# Altium project FPGA_Board.PrjPCB (part 1 of 2)
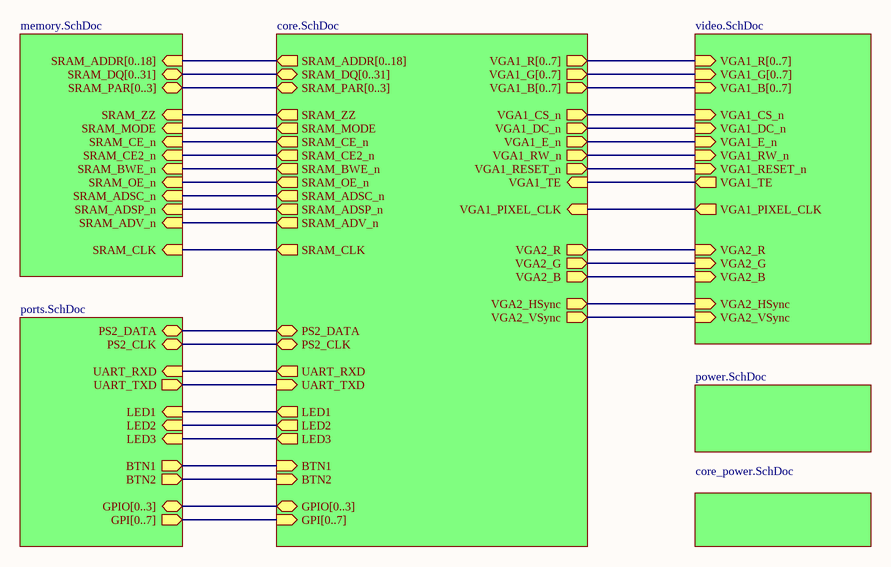
[diagram p0: FPGA_board.SchDoc]
7 sheets, 242 parts. Net scope: hierarchical (ports join the sheet entries above them; power ports are global).
Board file: FPGA_board.PcbDoc
Sheets:
  FPGA_board.SchDoc
    Designator = core.SchDoc
    Designator = Video.SchDoc
    Designator = ports.SchDoc
    Designator = power.SchDoc
    Designator = memory.SchDoc
    Designator = core_power.SchDoc

## Sheet FPGA_board.SchDoc
size A4

### Sub-sheets
Designator = core.SchDoc: SRAM_ADDR[0..18] (out), SRAM_DQ[0..31] (bidir), SRAM_PAR[0..3] (bidir), VGA1_R[0..7] (out), VGA1_G[0..7] (out), VGA1_B[0..7] (out), GPIO[0..3] (bidir), PS2_DATA (bidir), PS2_CLK (bidir), VGA1_PIXEL_CLK (in), VGA1_RESET_n (out), VGA1_CS_n (out), SRAM_ZZ (out), VGA1_TE (in), VGA1_E_n (out), VGA1_RW_n (out), VGA1_DC_n (out), BTN1 (in), BTN2 (in), LED1 (out), LED2 (out), LED3 (out), VGA2_R (out), VGA2_G (out), VGA2_B (out), VGA2_HSync (out), VGA2_VSync (out), SRAM_MODE (out), SRAM_CLK (out), SRAM_CE_n (out), SRAM_CE2_n (out), SRAM_BWE_n (out), SRAM_OE_n (out), SRAM_ADSC_n (out), SRAM_ADSP_n (out), SRAM_ADV_n (out), UART_RXD (out), UART_TXD (in), GPI[0..7] (in)
Designator = video.SchDoc: VGA1_R[0..7] (in), VGA1_G[0..7] (in), VGA1_B[0..7] (in), VGA1_CS_n (in), VGA1_DC_n (in), VGA1_RW_n (in), VGA1_E_n (in), VGA1_RESET_n (in), VGA1_TE (out), VGA1_PIXEL_CLK (out), VGA2_G (in), VGA2_B (in), VGA2_VSync (in), VGA2_HSync (in), VGA2_R (in)
Designator = ports.SchDoc: BTN1 (out), BTN2 (out), PS2_DATA (bidir), PS2_CLK (bidir), UART_RXD (in), UART_TXD (out), LED1 (in), LED2 (in), LED3 (in), GPIO[0..3] (bidir), GPI[0..7] (out)
Designator = power.SchDoc: no entries
Designator = memory.SchDoc: SRAM_ADDR[0..18] (in), SRAM_DQ[0..31] (bidir), SRAM_PAR[0..3] (bidir), SRAM_ZZ (in), SRAM_MODE (in), SRAM_CLK (in), SRAM_CE_n (in), SRAM_CE2_n (in), SRAM_BWE_n (in), SRAM_OE_n (in), SRAM_ADSC_n (in), SRAM_ADSP_n (in), SRAM_ADV_n (in)
Designator = core_power.SchDoc: no entries

### Nets
BTN1: sheet Designator/BTN1, sheet Designator/BTN1
BTN2: sheet Designator/BTN2, sheet Designator/BTN2
LED1: sheet Designator/LED1, sheet Designator/LED1
LED2: sheet Designator/LED2, sheet Designator/LED2
LED3: sheet Designator/LED3, sheet Designator/LED3
PS2_CLK: sheet Designator/PS2_CLK, sheet Designator/PS2_CLK
PS2_DATA: sheet Designator/PS2_DATA, sheet Designator/PS2_DATA
SRAM_ADSC_n: sheet Designator/SRAM_ADSC_n, sheet Designator/SRAM_ADSC_n
SRAM_ADSP_n: sheet Designator/SRAM_ADSP_n, sheet Designator/SRAM_ADSP_n
SRAM_ADV_n: sheet Designator/SRAM_ADV_n, sheet Designator/SRAM_ADV_n
SRAM_BWE_n: sheet Designator/SRAM_BWE_n, sheet Designator/SRAM_BWE_n
SRAM_CE2_n: sheet Designator/SRAM_CE2_n, sheet Designator/SRAM_CE2_n
SRAM_CE_n: sheet Designator/SRAM_CE_n, sheet Designator/SRAM_CE_n
SRAM_CLK: sheet Designator/SRAM_CLK, sheet Designator/SRAM_CLK
SRAM_MODE: sheet Designator/SRAM_MODE, sheet Designator/SRAM_MODE
SRAM_OE_n: sheet Designator/SRAM_OE_n, sheet Designator/SRAM_OE_n
SRAM_ZZ: sheet Designator/SRAM_ZZ, sheet Designator/SRAM_ZZ
UART_RXD: sheet Designator/UART_RXD, sheet Designator/UART_RXD
UART_TXD: sheet Designator/UART_TXD, sheet Designator/UART_TXD
VGA1_CS_n: sheet Designator/VGA1_CS_n, sheet Designator/VGA1_CS_n
VGA1_DC_n: sheet Designator/VGA1_DC_n, sheet Designator/VGA1_DC_n
VGA1_E_n: sheet Designator/VGA1_E_n, sheet Designator/VGA1_E_n
VGA1_PIXEL_CLK: sheet Designator/VGA1_PIXEL_CLK, sheet Designator/VGA1_PIXEL_CLK
VGA1_RESET_n: sheet Designator/VGA1_RESET_n, sheet Designator/VGA1_RESET_n
VGA1_RW_n: sheet Designator/VGA1_RW_n, sheet Designator/VGA1_RW_n
VGA1_TE: sheet Designator/VGA1_TE, sheet Designator/VGA1_TE
VGA2_B: sheet Designator/VGA2_B, sheet Designator/VGA2_B
VGA2_G: sheet Designator/VGA2_G, sheet Designator/VGA2_G
VGA2_HSync: sheet Designator/VGA2_HSync, sheet Designator/VGA2_HSync
VGA2_R: sheet Designator/VGA2_R, sheet Designator/VGA2_R
VGA2_VSync: sheet Designator/VGA2_VSync, sheet Designator/VGA2_VSync

## Sheet core.SchDoc
size A3
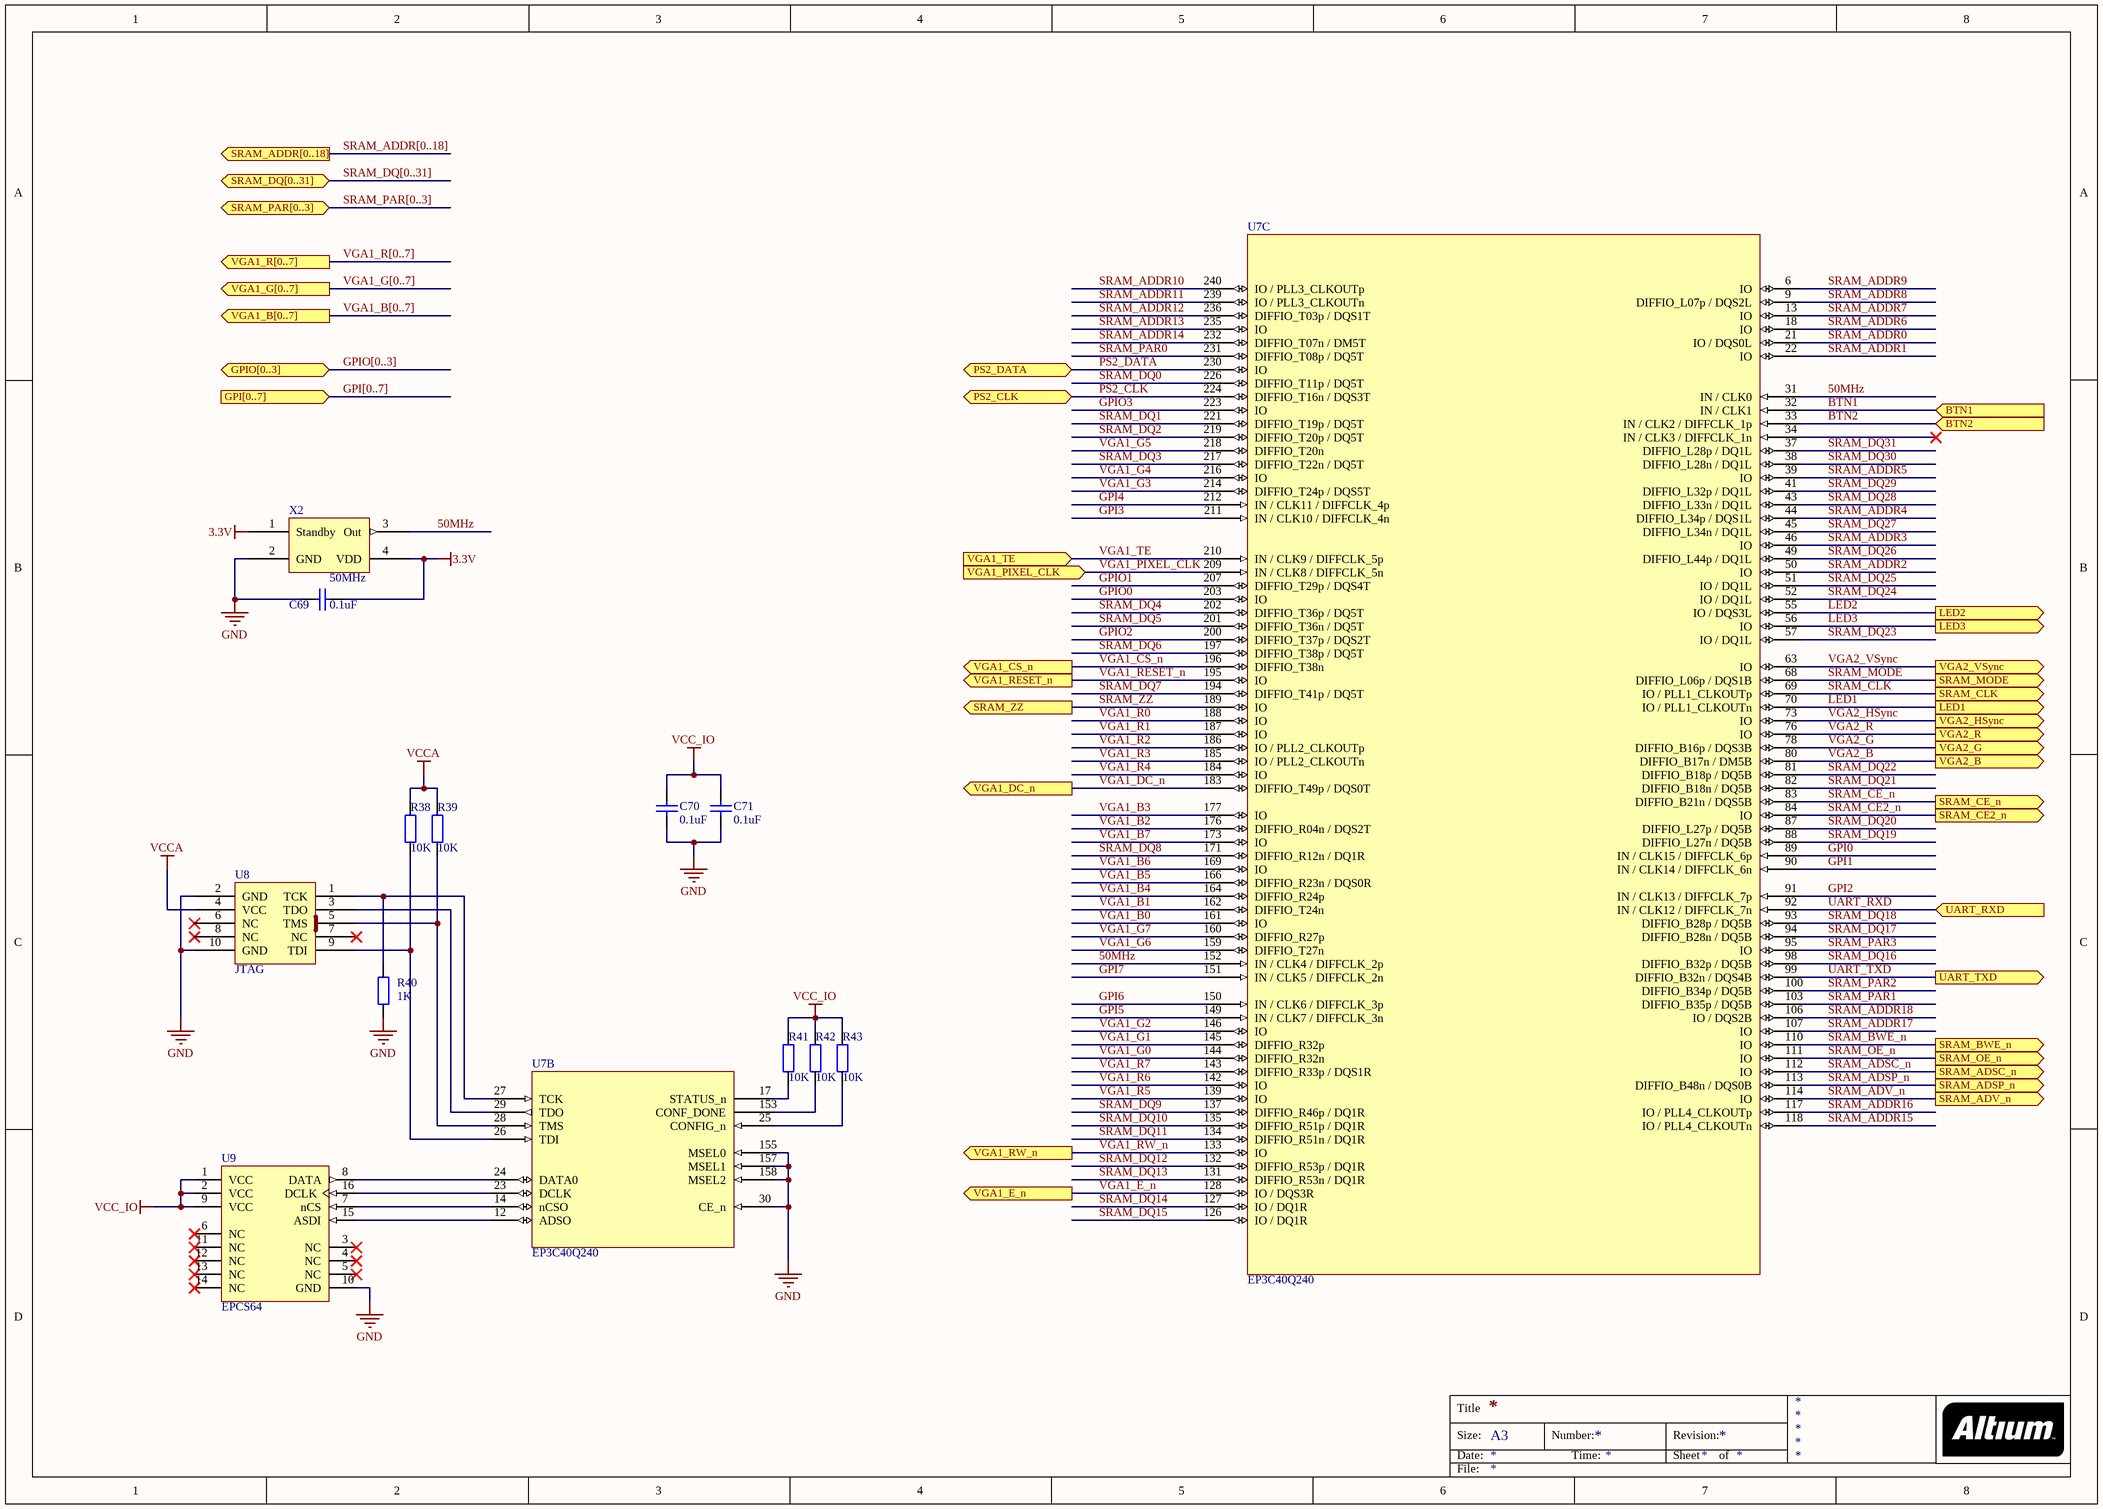
[diagram p1: core.SchDoc]

### Parts
C69  value 0.1uF  [0402]  (hidden comment: Cap)
C70  value 0.1uF  [0402]  (hidden comment: Cap)
C71  value 0.1uF  [0402]  (hidden comment: Cap)
R38  value 10K  [J1-0603]  (hidden comment: Res2)
R39  value 10K  [J1-0603]  (hidden comment: Res2)
R40  value 1K  [J1-0603]  (hidden comment: Res2)
R41  value 10K  [J1-0603]  (hidden comment: Res2)
R42  value 10K  [J1-0603]  (hidden comment: Res2)
R43  value 10K  [J1-0603]  (hidden comment: Res2)
U7  EP3C40Q240  [PQFP240]  (parts B,C of 3)
U8  JTAG  [JTAG_CONN]
U9  EPCS64  [SOIC16]
X2  50MHz  [ASDMB]

### Ports
BTN1 (in), BTN2 (in), GPI[0..7] (in), GPIO[0..3] (bidir), LED1 (out), LED2 (out), LED3 (out), PS2_CLK (bidir), PS2_DATA (bidir), SRAM_ADDR[0..18] (out), SRAM_ADSC_n (out), SRAM_ADSP_n (out), SRAM_ADV_n (out), SRAM_BWE_n (out), SRAM_CE2_n (out), SRAM_CE_n (out), SRAM_CLK (out), SRAM_DQ[0..31] (bidir), SRAM_MODE (out), SRAM_OE_n (out), SRAM_PAR[0..3] (bidir), SRAM_ZZ (out), UART_RXD (in), UART_TXD (out), VGA1_B[0..7] (out), VGA1_CS_n (out), VGA1_DC_n (out), VGA1_E_n (out), VGA1_G[0..7] (out), VGA1_PIXEL_CLK (in), VGA1_R[0..7] (out), VGA1_RESET_n (out), VGA1_RW_n (out), VGA1_TE (in), VGA2_B (out), VGA2_G (out), VGA2_HSync (out), VGA2_R (out), VGA2_VSync (out)

### Nets
3.3V: C69.2 C70.2 C71.2 R41.1 R42.1 R43.1 U9.1(VCC) U9.2(VCC) U9.9(VCC) X2.1(Standby) X2.4(VDD)  [also labelled VCC_IO]
GND: C69.1 C70.1 C71.1 R40.1 U7.30(CE_n) U7.155(MSEL0) U7.157(MSEL1) U7.158(MSEL2) U8.2(GND) U8.10(GND) U9.10(GND) X2.2(GND)
VCCA: R38.1 R39.1 U8.4(VCC)  [project net 2.5V]
50MHz: U7.31(IN_/_CLK0) U7.152(IN_/_CLK4_/_DIFFCLK_2p) X2.3(Out)
BTN1: U7.32(IN_/_CLK1) ; port BTN1
BTN2: U7.33(IN_/_CLK2_/_DIFFCLK_1p) ; port BTN2
GPI0: U7.89(IN_/_CLK15_/_DIFFCLK_6p)
GPI1: U7.90(IN_/_CLK14_/_DIFFCLK_6n)
GPI2: U7.91(IN_/_CLK13_/_DIFFCLK_7p)
GPI3: U7.211(IN_/_CLK10_/_DIFFCLK_4n)
GPI4: U7.212(IN_/_CLK11_/_DIFFCLK_4p)
GPI5: U7.149(IN_/_CLK7_/_DIFFCLK_3n)
GPI6: U7.150(IN_/_CLK6_/_DIFFCLK_3p)
GPI7: U7.151(IN_/_CLK5_/_DIFFCLK_2n)
GPIO0: U7.203(IO)
GPIO1: U7.207(DIFFIO_T29p_/_DQS4T)
GPIO2: U7.200(DIFFIO_T37p_/_DQS2T)
GPIO3: U7.223(IO)
LED1: U7.70(IO_/_PLL1_CLKOUTn) ; port LED1
LED2: U7.55(IO_/_DQS3L) ; port LED2
LED3: U7.56(IO) ; port LED3
PS2_CLK: U7.224(DIFFIO_T16n_/_DQS3T) ; port PS2_CLK
PS2_DATA: U7.230(IO) ; port PS2_DATA
SRAM_ADDR0: U7.21(IO_/_DQS0L)
SRAM_ADDR1: U7.22(IO)
SRAM_ADDR2: U7.50(IO)
SRAM_ADDR3: U7.46(IO)
SRAM_ADDR4: U7.44(DIFFIO_L34p_/_DQS1L)
SRAM_ADDR5: U7.39(IO)
SRAM_ADDR6: U7.18(IO)
SRAM_ADDR7: U7.13(IO)
SRAM_ADDR8: U7.9(DIFFIO_L07p_/_DQS2L)
SRAM_ADDR9: U7.6(IO)
SRAM_ADDR10: U7.240(IO_/_PLL3_CLKOUTp)
SRAM_ADDR11: U7.239(IO_/_PLL3_CLKOUTn)
SRAM_ADDR12: U7.236(DIFFIO_T03p_/_DQS1T)
SRAM_ADDR13: U7.235(IO)
SRAM_ADDR14: U7.232(DIFFIO_T07n_/_DM5T)
SRAM_ADDR15: U7.118(IO_/_PLL4_CLKOUTn)
SRAM_ADDR16: U7.117(IO_/_PLL4_CLKOUTp)
SRAM_ADDR17: U7.107(IO)
SRAM_ADDR18: U7.106(IO_/_DQS2B)
SRAM_ADSC_n: U7.112(IO) ; port SRAM_ADSC_n
SRAM_ADSP_n: U7.113(DIFFIO_B48n_/_DQS0B) ; port SRAM_ADSP_n
SRAM_ADV_n: U7.114(IO) ; port SRAM_ADV_n
SRAM_BWE_n: U7.110(IO) ; port SRAM_BWE_n
SRAM_CE2_n: U7.84(IO) ; port SRAM_CE2_n
SRAM_CE_n: U7.83(DIFFIO_B21n_/_DQS5B) ; port SRAM_CE_n
SRAM_CLK: U7.69(IO_/_PLL1_CLKOUTp) ; port SRAM_CLK
SRAM_DQ0: U7.226(DIFFIO_T11p_/_DQ5T)
SRAM_DQ1: U7.221(DIFFIO_T19p_/_DQ5T)
SRAM_DQ2: U7.219(DIFFIO_T20p_/_DQ5T)
SRAM_DQ3: U7.217(DIFFIO_T22n_/_DQ5T)
SRAM_DQ4: U7.202(DIFFIO_T36p_/_DQ5T)
SRAM_DQ5: U7.201(DIFFIO_T36n_/_DQ5T)
SRAM_DQ6: U7.197(DIFFIO_T38p_/_DQ5T)
SRAM_DQ7: U7.194(DIFFIO_T41p_/_DQ5T)
SRAM_DQ8: U7.171(DIFFIO_R12n_/_DQ1R)
SRAM_DQ9: U7.137(DIFFIO_R46p_/_DQ1R)
SRAM_DQ10: U7.135(DIFFIO_R51p_/_DQ1R)
SRAM_DQ11: U7.134(DIFFIO_R51n_/_DQ1R)
SRAM_DQ12: U7.132(DIFFIO_R53p_/_DQ1R)
SRAM_DQ13: U7.131(DIFFIO_R53n_/_DQ1R)
SRAM_DQ14: U7.127(IO_/_DQ1R)
SRAM_DQ15: U7.126(IO_/_DQ1R)
SRAM_DQ16: U7.98(DIFFIO_B32p_/_DQ5B)
SRAM_DQ17: U7.94(DIFFIO_B28n_/_DQ5B)
SRAM_DQ18: U7.93(DIFFIO_B28p_/_DQ5B)
SRAM_DQ19: U7.88(DIFFIO_L27n_/_DQ5B)
SRAM_DQ20: U7.87(DIFFIO_L27p_/_DQ5B)
SRAM_DQ21: U7.82(DIFFIO_B18n_/_DQ5B)
SRAM_DQ22: U7.81(DIFFIO_B18p_/_DQ5B)
SRAM_DQ23: U7.57(IO_/_DQ1L)
SRAM_DQ24: U7.52(IO_/_DQ1L)
SRAM_DQ25: U7.51(IO_/_DQ1L)
SRAM_DQ26: U7.49(DIFFIO_L44p_/_DQ1L)
SRAM_DQ27: U7.45(DIFFIO_L34n_/_DQ1L)
SRAM_DQ28: U7.43(DIFFIO_L33n_/_DQ1L)
SRAM_DQ29: U7.41(DIFFIO_L32p_/_DQ1L)
SRAM_DQ30: U7.38(DIFFIO_L28n_/_DQ1L)
SRAM_DQ31: U7.37(DIFFIO_L28p_/_DQ1L)
SRAM_MODE: U7.68(DIFFIO_L06p_/_DQS1B) ; port SRAM_MODE
SRAM_OE_n: U7.111(IO) ; port SRAM_OE_n
SRAM_PAR0: U7.231(DIFFIO_T08p_/_DQ5T)
SRAM_PAR1: U7.103(DIFFIO_B35p_/_DQ5B)
SRAM_PAR2: U7.100(DIFFIO_B34p_/_DQ5B)
SRAM_PAR3: U7.95(IO)
SRAM_ZZ: U7.189(IO) ; port SRAM_ZZ
UART_RXD: U7.92(IN_/_CLK12_/_DIFFCLK_7n) ; port UART_RXD
UART_TXD: U7.99(DIFFIO_B32n_/_DQS4B) ; port UART_TXD
VGA1_B0: U7.161(IO)
VGA1_B1: U7.162(DIFFIO_T24n)
VGA1_B2: U7.176(DIFFIO_R04n_/_DQS2T)
VGA1_B3: U7.177(IO)
VGA1_B4: U7.164(DIFFIO_R24p)
VGA1_B5: U7.166(DIFFIO_R23n_/_DQS0R)
VGA1_B6: U7.169(IO)
VGA1_B7: U7.173(IO)
VGA1_CS_n: U7.196(DIFFIO_T38n) ; port VGA1_CS_n
VGA1_DC_n: U7.183(DIFFIO_T49p_/_DQS0T) ; port VGA1_DC_n
VGA1_E_n: U7.128(IO_/_DQS3R) ; port VGA1_E_n
VGA1_G0: U7.144(DIFFIO_R32n)
VGA1_G1: U7.145(DIFFIO_R32p)
VGA1_G2: U7.146(IO)
VGA1_G3: U7.214(DIFFIO_T24p_/_DQS5T)
VGA1_G4: U7.216(IO)
VGA1_G5: U7.218(DIFFIO_T20n)
VGA1_G6: U7.159(DIFFIO_T27n)
VGA1_G7: U7.160(DIFFIO_R27p)
VGA1_PIXEL_CLK: U7.209(IN_/_CLK8_/_DIFFCLK_5n) ; port VGA1_PIXEL_CLK
VGA1_R0: U7.188(IO)
VGA1_R1: U7.187(IO)
VGA1_R2: U7.186(IO_/_PLL2_CLKOUTp)
VGA1_R3: U7.185(IO_/_PLL2_CLKOUTn)
VGA1_R4: U7.184(IO)
VGA1_R5: U7.139(IO)
VGA1_R6: U7.142(IO)
VGA1_R7: U7.143(DIFFIO_R33p_/_DQS1R)
VGA1_RESET_n: U7.195(IO) ; port VGA1_RESET_n
VGA1_RW_n: U7.133(IO) ; port VGA1_RW_n
VGA1_TE: U7.210(IN_/_CLK9_/_DIFFCLK_5p) ; port VGA1_TE
VGA2_B: U7.80(DIFFIO_B17n_/_DM5B) ; port VGA2_B
VGA2_G: U7.78(DIFFIO_B16p_/_DQS3B) ; port VGA2_G
VGA2_HSync: U7.73(IO) ; port VGA2_HSync
VGA2_R: U7.76(IO) ; port VGA2_R
VGA2_VSync: U7.63(IO) ; port VGA2_VSync
NetR38_2: R38.2 U7.26(TDI) U8.9(TDI)
NetR39_2: R39.2 U7.28(TMS) U8.5(TMS)
NetR40_2: R40.2 U7.27(TCK) U8.1(TCK)
NetR41_2: R41.2 U7.17(STATUS_n)
NetR42_2: R42.2 U7.153(CONF_DONE)
NetR43_2: R43.2 U7.25(CONFIG_n)
NetU7_12: U7.12(ADSO) U9.15(ASDI)
NetU7_14: U7.14(nCSO) U9.7(nCS)
NetU7_23: U7.23(DCLK) U9.16(DCLK)
NetU7_24: U7.24(DATA0) U9.8(DATA)
NetU7_29: U7.29(TDO) U8.3(TDO)

Not connected (* = marked no-connect by the designer): U7 34(IN_/_CLK3_/_DIFFCLK_1n)*; U8 6(NC)* 7(NC)* 8(NC)*; U9 3(NC)* 4(NC)* 5(NC)* 6(NC)* 11(NC)* 12(NC)* 13(NC)* 14(NC)*

### Buses and harness runs
bus GPI[0..7] = port GPI[0..7]
bus GPIO[0..3] = port GPIO[0..3]
bus SRAM_ADDR[0..18] = port SRAM_ADDR[0..18]
bus SRAM_DQ[0..31] = port SRAM_DQ[0..31]
bus SRAM_PAR[0..3] = port SRAM_PAR[0..3]
bus VGA1_B[0..7] = port VGA1_B[0..7]
bus VGA1_G[0..7] = port VGA1_G[0..7]
bus VGA1_R[0..7] = port VGA1_R[0..7]

### Notes on the sheet
- Title
- Size:
- Date:
- A3
- Number:
- Time:
- Revision:
- Sheet
- of
- File:

### Library data of the parts
C69-C71 = Cap: Capacitor; Published: 8-Jun-2000; LatestRevisionDate: 17-Jul-2002; LatestRevisionNote: Re-released for DXP Platform.; PackageReference: RAD-0.3; Publisher: Altium Limited; PackageDescription: Radial Cap, Thru-Hole; 2 Leads; 0.3 in Pin Spacing
R38-R43 = Res2: Resistor; Published: 8-Jun-2000; LatestRevisionDate: 17-Jul-2002; LatestRevisionNote: Re-released for DXP Platform.; PackageReference: AXIAL-0.4; Publisher: Altium Limited; PackageDescription: Axial Device, Thru-Hole; 2 Leads; 0.4 in Pin Spacing
U8 = JTAG_CONN
U9 = EPCS16SI16N: EPCS16 Series, In-system programmable 3.3V serial configuration device, 16-Pin SOIC, 16-Megabit, Industrial Grade, Pb-Free; Configures: Cyclone II, Stratix II, & Cyclone Devices; Published: 4-Mar-2005; LatestRevisionDate: 13-Apr-2006; LatestRevisionNote: IPC-7351 Footprint Added.; DatasheetVersion: ver2.0, Oct-2003; PackageVersion: ver14.2, Oct-2005; PackageReference: SOIC16; Publisher: Altium Limited; PackageDescription: 16-Pin Small Outline Integrated Circuit Package (SOIC16); Supplier 1: Digi-Key; Supplier Part Number 1: 544-1240-5-ND; Supplier 2: Farnell; Supplier Part Number 2: 1453493; Supplier 3: Farnell; Supplier Part Number 3: 1662261; Code_JEDEC: MS-013-AA; Code_IPC: SOIC127P1030-16; ComponentLink1Description: Manufacturer Link; ComponentLink1URL: http://www.altera.com/products/devices/config/cfg-index.html; ComponentLink2Description: Configuration Handbook; ComponentLink2URL: http://www.altera.com/literature/hb/cfg/config_handbook.pdf; ComponentLink3Description: Pinout Specification; ComponentLink3URL: http://www.altera.com/literature/hb/cfg/config_handbook.pdf; ComponentLink4Description: Packaging Specification; ComponentLink4URL: http://www.altera.com/support/devices/packaging/specifications/pkg-pin/pdf/016-SOIC.pdf
X2 = ASDMB-50.000MHZ-LY-T

## Sheet Video.SchDoc
size A3
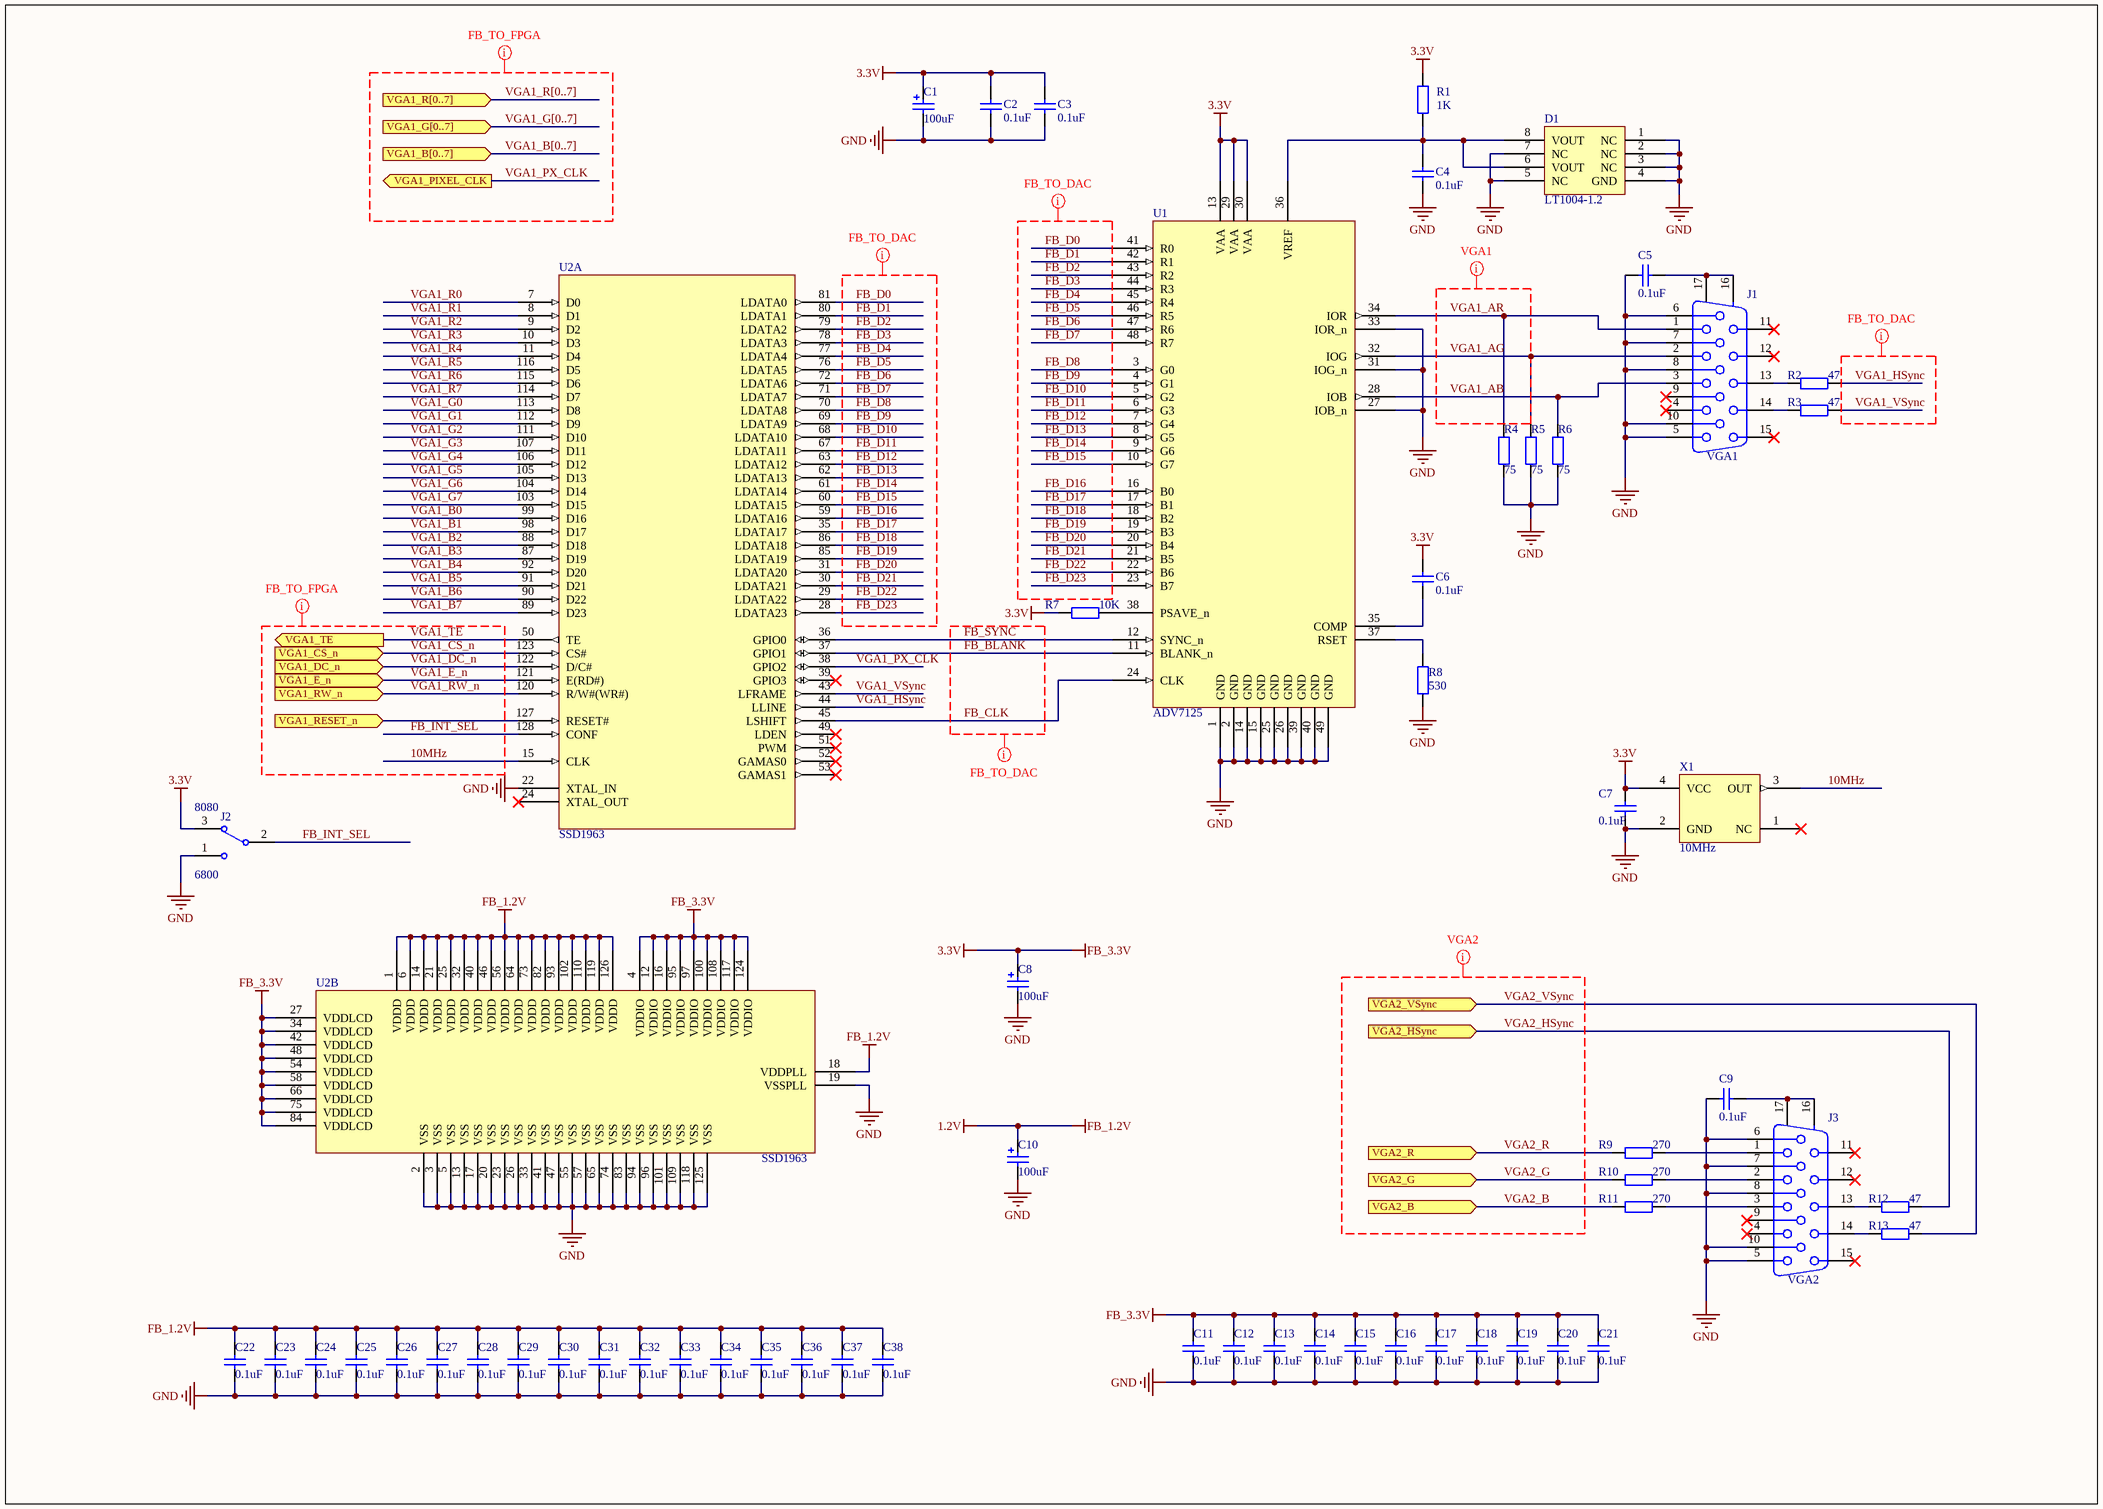
[diagram p2: Video.SchDoc]

### Parts
C1  value 100uF  [C1206_POLARIZED]  (hidden comment: Cap Pol2)
C2  value 0.1uF  [0402]  (hidden comment: Cap)
C3  value 0.1uF  [0402]  (hidden comment: Cap)
C4  value 0.1uF  [0402]  (hidden comment: Cap)
C5  value 0.1uF  [0402]  (hidden comment: Cap)
C6  value 0.1uF  [0402]  (hidden comment: Cap)
C7  value 0.1uF  [0402]  (hidden comment: Cap)
C8  value 100uF  [C1206_POLARIZED]  (hidden comment: Cap Pol2)
C9  value 0.1uF  [0402]  (hidden comment: Cap)
C10  value 100uF  [C1206_POLARIZED]  (hidden comment: Cap Pol2)
C11  value 0.1uF  [0402]  (hidden comment: Cap)
C12  value 0.1uF  [0402]  (hidden comment: Cap)
C13  value 0.1uF  [0402]  (hidden comment: Cap)
C14  value 0.1uF  [0402]  (hidden comment: Cap)
C15  value 0.1uF  [0402]  (hidden comment: Cap)
C16  value 0.1uF  [0402]  (hidden comment: Cap)
C17  value 0.1uF  [0402]  (hidden comment: Cap)
C18  value 0.1uF  [0402]  (hidden comment: Cap)
C19  value 0.1uF  [0402]  (hidden comment: Cap)
C20  value 0.1uF  [0402]  (hidden comment: Cap)
C21  value 0.1uF  [0402]  (hidden comment: Cap)
C22  value 0.1uF  [0402]  (hidden comment: Cap)
C23  value 0.1uF  [0402]  (hidden comment: Cap)
C24  value 0.1uF  [0402]  (hidden comment: Cap)
C25  value 0.1uF  [0402]  (hidden comment: Cap)
C26  value 0.1uF  [0402]  (hidden comment: Cap)
C27  value 0.1uF  [0402]  (hidden comment: Cap)
C28  value 0.1uF  [0402]  (hidden comment: Cap)
C29  value 0.1uF  [0402]  (hidden comment: Cap)
C30  value 0.1uF  [0402]  (hidden comment: Cap)
C31  value 0.1uF  [0402]  (hidden comment: Cap)
C32  value 0.1uF  [0402]  (hidden comment: Cap)
C33  value 0.1uF  [0402]  (hidden comment: Cap)
C34  value 0.1uF  [0402]  (hidden comment: Cap)
C35  value 0.1uF  [0402]  (hidden comment: Cap)
C36  value 0.1uF  [0402]  (hidden comment: Cap)
C37  value 0.1uF  [0402]  (hidden comment: Cap)
C38  value 0.1uF  [0402]  (hidden comment: Cap)
D1  LT1004-1.2  [S8]
J1  VGA1  [VGA_Socket]
J2  FB_INTERFACE  [HDR1X3]  (value not drawn)
J3  VGA2  [VGA_Socket]
R1  value 1K  [J1-0603]  (hidden comment: Res2)
R2  value 47  [J1-0603]  (hidden comment: Res2)
R3  value 47  [J1-0603]  (hidden comment: Res2)
R4  value 75  [J1-0603]  (hidden comment: Res2)
R5  value 75  [J1-0603]  (hidden comment: Res2)
R6  value 75  [J1-0603]  (hidden comment: Res2)
R7  value 10K  [J1-0603]  (hidden comment: Res2)
R8  value 530  [J1-0603]  (hidden comment: Res2)
R9  value 270  [6-0805_N]  (hidden comment: Res2)
R10  value 270  [6-0805_N]  (hidden comment: Res2)
R11  value 270  [6-0805_N]  (hidden comment: Res2)
R12  value 47  [J1-0603]  (hidden comment: Res2)
R13  value 47  [J1-0603]  (hidden comment: Res2)
U1  ADV7125  [LFCSP_VQ48]
U2  SSD1963  [LQFP128-0.4]  (parts A,B of 2)
X1  10MHz  [FOX924]

### Ports
VGA1_B[0..7] (in), VGA1_CS_n (in), VGA1_DC_n (in), VGA1_E_n (in), VGA1_G[0..7] (in), VGA1_PIXEL_CLK (out), VGA1_R[0..7] (in), VGA1_RESET_n (in), VGA1_RW_n (in), VGA1_TE (out), VGA2_B (in), VGA2_G (in), VGA2_HSync (in), VGA2_R (in), VGA2_VSync (in)

### Nets
1.2V: C10.1 C22.1 C23.1 C24.1 C25.1 C26.1 C27.1 C28.1 C29.1 C30.1 C31.1 C32.1 C33.1 C34.1 C35.1 C36.1 C37.1 C38.1 U2.1(VDDD) U2.6(VDDD) U2.14(VDDD) U2.18(VDDPLL) U2.21(VDDD) U2.25(VDDD) U2.32(VDDD) U2.40(VDDD) U2.46(VDDD) U2.56(VDDD) U2.64(VDDD) U2.73(VDDD) U2.82(VDDD) U2.93(VDDD) U2.102(VDDD) U2.110(VDDD) U2.119(VDDD) U2.126(VDDD)  [also labelled FB_1.2V]
3.3V: C1.1 C2.2 C3.2 C6.2 C7.1 C8.1 C11.1 C12.1 C13.1 C14.1 C15.1 C16.1 C17.1 C18.1 C19.1 C20.1 C21.1 J2.3 R1.2 R7.1 U1.13(VAA) U1.29(VAA) U1.30(VAA) U2.4(VDDIO) U2.12(VDDIO) U2.16(VDDIO) U2.27(VDDLCD) U2.34(VDDLCD) U2.42(VDDLCD) U2.48(VDDLCD) U2.54(VDDLCD) U2.58(VDDLCD) U2.66(VDDLCD) U2.75(VDDLCD) U2.84(VDDLCD) U2.95(VDDIO) U2.97(VDDIO) U2.100(VDDIO) U2.108(VDDIO) U2.117(VDDIO) U2.124(VDDIO) X1.4(VCC)  [also labelled FB_3.3V]
GND: C1.2 C2.1 C3.1 C4.2 C5.1 C7.2 C8.2 C9.1 C10.2 C11.2 C12.2 C13.2 C14.2 C15.2 C16.2 C17.2 C18.2 C19.2 C20.2 C21.2 C22.2 C23.2 C24.2 C25.2 C26.2 C27.2 C28.2 C29.2 C30.2 C31.2 C32.2 C33.2 C34.2 C35.2 C36.2 C37.2 C38.2 D1.1(NC) D1.2(NC) D1.3(NC) D1.4(GND) D1.5(NC) D1.7(NC) J1.5 J1.6 J1.7 J1.8 J1.10 J2.1 J3.5 J3.6 J3.7 J3.8 J3.10 R4.1 R5.2 R6.2 R8.1 U1.1(GND) U1.2(GND) U1.14(GND) U1.15(GND) U1.25(GND) U1.26(GND) U1.27(IOB_n) U1.31(IOG_n) U1.33(IOR_n) U1.39(GND) U1.40(GND) U1.49(GND) U2.2(VSS) U2.3(VSS) U2.5(VSS) U2.13(VSS) U2.17(VSS) U2.19(VSSPLL) U2.20(VSS) U2.22(XTAL_IN) U2.23(VSS) U2.26(VSS) U2.33(VSS) U2.41(VSS) U2.47(VSS) U2.55(VSS) U2.57(VSS) U2.65(VSS) U2.74(VSS) U2.83(VSS) U2.94(VSS) U2.96(VSS) U2.101(VSS) U2.109(VSS) U2.118(VSS) U2.125(VSS) X1.2(GND)
10MHz: U2.15(CLK) X1.3(OUT)
FB_BLANK: U1.11(BLANK_n) U2.37(GPIO1)
FB_CLK: U1.24(CLK) U2.45(LSHIFT)
FB_D0: U1.41(R0) U2.81(LDATA0)
FB_D1: U1.42(R1) U2.80(LDATA1)
FB_D2: U1.43(R2) U2.79(LDATA2)
FB_D3: U1.44(R3) U2.78(LDATA3)
FB_D4: U1.45(R4) U2.77(LDATA4)
FB_D5: U1.46(R5) U2.76(LDATA5)
FB_D6: U1.47(R6) U2.72(LDATA6)
FB_D7: U1.48(R7) U2.71(LDATA7)
FB_D8: U1.3(G0) U2.70(LDATA8)
FB_D9: U1.4(G1) U2.69(LDATA9)
FB_D10: U1.5(G2) U2.68(LDATA10)
FB_D11: U1.6(G3) U2.67(LDATA11)
FB_D12: U1.7(G4) U2.63(LDATA12)
FB_D13: U1.8(G5) U2.62(LDATA13)
FB_D14: U1.9(G6) U2.61(LDATA14)
FB_D15: U1.10(G7) U2.60(LDATA15)
FB_D16: U1.16(B0) U2.59(LDATA16)
FB_D17: U1.17(B1) U2.35(LDATA17)
FB_D18: U1.18(B2) U2.86(LDATA18)
FB_D19: U1.19(B3) U2.85(LDATA19)
FB_D20: U1.20(B4) U2.31(LDATA20)
FB_D21: U1.21(B5) U2.30(LDATA21)
FB_D22: U1.22(B6) U2.29(LDATA22)
FB_D23: U1.23(B7) U2.28(LDATA23)
FB_INT_SEL: J2.2 U2.128(CONF)
FB_SYNC: U1.12(SYNC_n) U2.36(GPIO0)
VGA1_AB: J1.3 R6.1 U1.28(IOB)
VGA1_AG: J1.2 R5.1 U1.32(IOG)
VGA1_AR: J1.1 R4.2 U1.34(IOR)
VGA1_B0: U2.99(D16)
VGA1_B1: U2.98(D17)
VGA1_B2: U2.88(D18)
VGA1_B3: U2.87(D19)
VGA1_B4: U2.92(D20)
VGA1_B5: U2.91(D21)
VGA1_B6: U2.90(D22)
VGA1_B7: U2.89(D23)
VGA1_CS_n: U2.123(CS#) ; port VGA1_CS_n
VGA1_DC_n: U2.122(D/C#) ; port VGA1_DC_n
VGA1_E_n: U2.121(E(RD#)) ; port VGA1_E_n
VGA1_G0: U2.113(D8)
VGA1_G1: U2.112(D9)
VGA1_G2: U2.111(D10)
VGA1_G3: U2.107(D11)
VGA1_G4: U2.106(D12)
VGA1_G5: U2.105(D13)
VGA1_G6: U2.104(D14)
VGA1_G7: U2.103(D15)
VGA1_HSync: R2.2 U2.44(LLINE)
VGA1_PX_CLK: U2.38(GPIO2) ; port VGA1_PIXEL_CLK  [project net VGA1_PIXEL_CLK]
VGA1_R0: U2.7(D0)
VGA1_R1: U2.8(D1)
VGA1_R2: U2.9(D2)
VGA1_R3: U2.10(D3)
VGA1_R4: U2.11(D4)
VGA1_R5: U2.116(D5)
VGA1_R6: U2.115(D6)
VGA1_R7: U2.114(D7)
VGA1_RESET_n: U2.127(RESET#) ; port VGA1_RESET_n
VGA1_RW_n: U2.120(R/W#(WR#)) ; port VGA1_RW_n
VGA1_TE: U2.50(TE) ; port VGA1_TE
VGA1_VSync: R3.2 U2.43(LFRAME)
VGA2_B: R11.2 ; port VGA2_B
VGA2_G: R10.2 ; port VGA2_G
VGA2_HSync: R12.2 ; port VGA2_HSync
VGA2_R: R9.2 ; port VGA2_R
VGA2_VSync: R13.2 ; port VGA2_VSync
NetC4_1: C4.1 D1.6(VOUT) D1.8(VOUT) R1.1 U1.36(VREF)
NetC5_2: C5.2 J1.16(MH1) J1.17(MH2)
NetC6_1: C6.1 U1.35(COMP)
NetC9_2: C9.2 J3.16(MH1) J3.17(MH2)
NetJ1_13: J1.13 R2.1
NetJ1_14: J1.14 R3.1
NetJ3_1: J3.1 R9.1
NetJ3_2: J3.2 R10.1
NetJ3_3: J3.3 R11.1
NetJ3_13: J3.13 R12.1
NetJ3_14: J3.14 R13.1
NetR7_2: R7.2 U1.38(PSAVE_n)
NetR8_2: R8.2 U1.37(RSET)

Not connected (* = marked no-connect by the designer): J1 4* 9* 11* 12* 15*; J3 4* 9* 11* 12* 15*; U2 24(XTAL_OUT)* 39(GPIO3)* 49(LDEN)* 51(PWM)* 52(GAMAS0)* 53(GAMAS1)*; X1 1(NC)*

### Buses and harness runs
bus VGA1_B[0..7] = port VGA1_B[0..7]
bus VGA1_G[0..7] = port VGA1_G[0..7]
bus VGA1_R[0..7] = port VGA1_R[0..7]

### Layout directives
net class FB_TO_DAC: FB_BLANK, FB_CLK, FB_D0, FB_D1, FB_D2, FB_D3, FB_D4, FB_D5, FB_D6, FB_D7, FB_D8, FB_D9, FB_D10, FB_D11, FB_D12, FB_D13, FB_D14, FB_D15, FB_D16, FB_D17, FB_D18, FB_D19, FB_D20, FB_D21, FB_D22, FB_D23, FB_SYNC, VGA1_HSync, VGA1_VSync
net class FB_TO_FPGA: 10MHz, FB_INT_SEL, VGA1_B[0..7], VGA1_CS_n, VGA1_DC_n, VGA1_E_n, VGA1_G[0..7], VGA1_PX_CLK, VGA1_R[0..7], VGA1_RW_n, VGA1_TE
net class VGA2: VGA2_B, VGA2_G, VGA2_HSync, VGA2_R, VGA2_VSync
net class VGA1: VGA1_AB, VGA1_AG, VGA1_AR

### Notes on the sheet
- (near J2) 8080
- (near J2) 6800
- Title
- Size:
- Date:
- A3
- Number:
- Time:
- Revision:
- Sheet
- of
- File:

### Library data of the parts
C1 C8 C10 = Cap Pol2: Polarized Capacitor (Axial); Published: 8-Jun-2000; LatestRevisionDate: 17-Jul-2002; LatestRevisionNote: Re-released for DXP Platform.; PackageReference: POLAR0.8; Publisher: Altium Limited; PackageDescription: Polarized Capacitor; 2 Leads
C2-C7 C9 C11-C38 = Cap: Capacitor; Published: 8-Jun-2000; LatestRevisionDate: 17-Jul-2002; LatestRevisionNote: Re-released for DXP Platform.; PackageReference: RAD-0.3; Publisher: Altium Limited; PackageDescription: Radial Cap, Thru-Hole; 2 Leads; 0.3 in Pin Spacing
J1 J3 = Connector 15: Receptacle Assembly, 15-Pin, Sim Line Connector; PackageDocument: B; Positions: 15; Gender: Female; Orientation: Right Angle
J2 = SW-SPDT: Published: 24-Mar-1999; LatestRevisionDate: 17-Dec-2003; LatestRevisionNote: Schematic revised, PCB Footprint replaced.; DatasheetVersion: 05-Dec-2000; PackageReference: TL36WW15050; Publisher: Altium Limited; PackageDescription: Switch; 4 Leads; ComponentLink1Description: Manufacturer Link; ComponentLink1URL: http://www.apem.com
R1-R13 = Res2: Resistor; Published: 8-Jun-2000; LatestRevisionDate: 17-Jul-2002; LatestRevisionNote: Re-released for DXP Platform.; PackageReference: AXIAL-0.4; Publisher: Altium Limited; PackageDescription: Axial Device, Thru-Hole; 2 Leads; 0.4 in Pin Spacing
X1 = FOX924B-10MHz

## Sheet ports.SchDoc
size A3
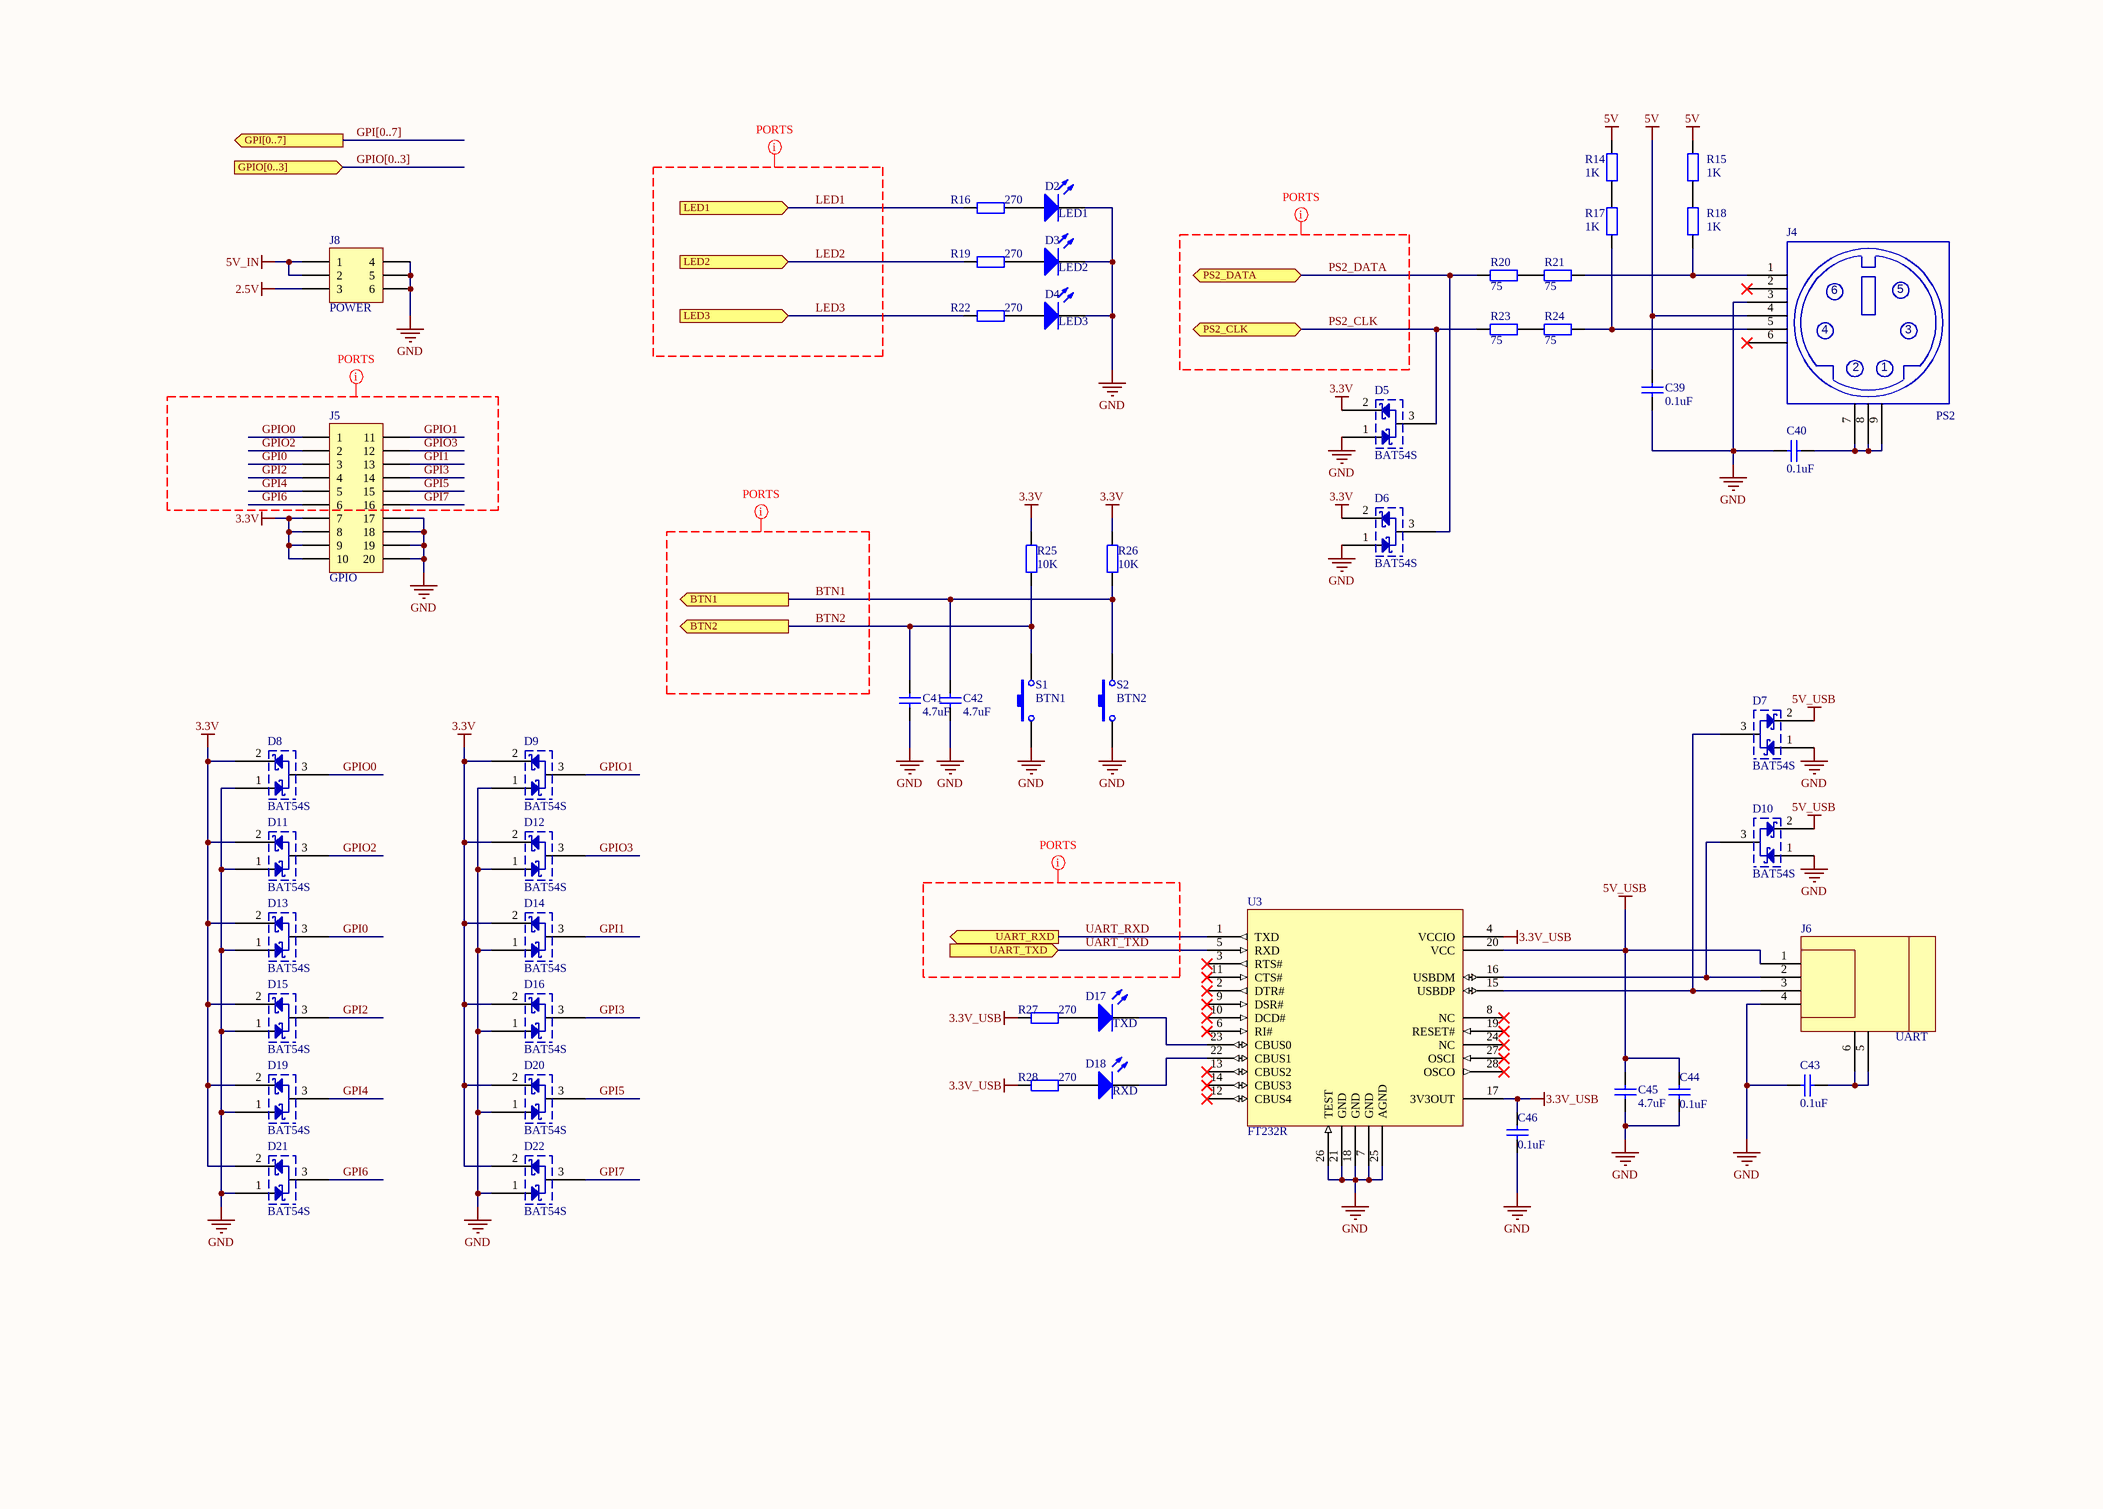
[diagram p3: ports.SchDoc]

### Parts
C39  value 0.1uF  [0402]  (hidden comment: Cap)
C40  value 0.1uF  [0402]  (hidden comment: Cap)
C41  value 4.7uF  [C0805]  (hidden comment: Cap)
C42  value 4.7uF  [C0805]  (hidden comment: Cap)
C43  value 0.1uF  [0402]  (hidden comment: Cap)
C44  value 0.1uF  [0402]  (hidden comment: Cap)
C45  value 4.7uF  [C0805]  (hidden comment: Cap)
C46  value 0.1uF  [0402]  (hidden comment: Cap)
D2  LED1  [LED]
D3  LED2  [LED]
D4  LED3  [LED]
D5  BAT54S  [SOT23_BAT54S]
D6  BAT54S  [SOT23_BAT54S]
D7  BAT54S  [SOT23_BAT54S]
D8  BAT54S  [SOT23_BAT54S]
D9  BAT54S  [SOT23_BAT54S]
D10  BAT54S  [SOT23_BAT54S]
D11  BAT54S  [SOT23_BAT54S]
D12  BAT54S  [SOT23_BAT54S]
D13  BAT54S  [SOT23_BAT54S]
D14  BAT54S  [SOT23_BAT54S]
D15  BAT54S  [SOT23_BAT54S]
D16  BAT54S  [SOT23_BAT54S]
D17  TXD  [LED]
D18  RXD  [LED]
D19  BAT54S  [SOT23_BAT54S]
D20  BAT54S  [SOT23_BAT54S]
D21  BAT54S  [SOT23_BAT54S]
D22  BAT54S  [SOT23_BAT54S]
J4  PS2  [PS2-6PIN]
J5  GPIO  [HDR2X10_CEN]
J6  UART  [USB_B]
J8  POWER  [HDR2X3_CEN]
R14  value 1K  [J1-0603]  (hidden comment: Res2)
R15  value 1K  [J1-0603]  (hidden comment: Res2)
R16  value 270  [6-0805_N]  (hidden comment: Res2)
R17  value 1K  [J1-0603]  (hidden comment: Res2)
R18  value 1K  [J1-0603]  (hidden comment: Res2)
R19  value 270  [6-0805_N]  (hidden comment: Res2)
R20  value 75  [J1-0603]  (hidden comment: Res2)
R21  value 75  [J1-0603]  (hidden comment: Res2)
R22  value 270  [6-0805_N]  (hidden comment: Res2)
R23  value 75  [J1-0603]  (hidden comment: Res2)
R24  value 75  [J1-0603]  (hidden comment: Res2)
R25  value 10K  [J1-0603]  (hidden comment: Res2)
R26  value 10K  [J1-0603]  (hidden comment: Res2)
R27  value 270  [6-0805_N]  (hidden comment: Res2)
R28  value 270  [6-0805_N]  (hidden comment: Res2)
S1  BTN1  [PUSHBUTTON]
S2  BTN2  [PUSHBUTTON]
U3  FT232R  [SSOP28]

### Ports
BTN1 (out), BTN2 (out), GPI[0..7] (out), GPIO[0..3] (in), LED1 (in), LED2 (in), LED3 (in), PS2_CLK (bidir), PS2_DATA (bidir), UART_RXD (out), UART_TXD (in)

### Nets
2.5V: J8.3
3.3V: D5.2 D6.2 D8.2 D9.2 D11.2 D12.2 D13.2 D14.2 D15.2 D16.2 D19.2 D20.2 D21.2 D22.2 J5.7 J5.8 J5.9 J5.10 R25.1 R26.1
3.3V_USB: C46.1 R27.2 R28.2 U3.4(VCCIO) U3.17(3V3OUT)
5V: C39.2 J4.4 R14.2 R15.2
5V_IN: J8.1 J8.2
5V_USB: C44.1 C45.2 D7.2 D10.2 J6.1 U3.20(VCC)
GND: C39.1 C40.1 C41.1 C42.1 C43.1 C44.2 C45.1 C46.2 D2.2(K) D3.2(K) D4.2(K) D5.1 D6.1 D7.1 D8.1 D9.1 D10.1 D11.1 D12.1 D13.1 D14.1 D15.1 D16.1 D19.1 D20.1 D21.1 D22.1 J4.3 J5.17 J5.18 J5.19 J5.20 J6.4 J8.4 J8.5 J8.6 S1.1 S2.1 U3.7(GND) U3.18(GND) U3.21(GND) U3.25(AGND) U3.26(TEST)
BTN1: C42.2 R26.2 S2.2 ; port BTN1
BTN2: C41.2 R25.2 S1.2 ; port BTN2
GPI0: D13.3 J5.3
GPI1: D14.3 J5.13
GPI2: D15.3 J5.4
GPI3: D16.3 J5.14
GPI4: D19.3 J5.5
GPI5: D20.3 J5.15
GPI6: D21.3 J5.6
GPI7: D22.3 J5.16
GPIO0: D8.3 J5.1
GPIO1: D9.3 J5.11
GPIO2: D11.3 J5.2
GPIO3: D12.3 J5.12
LED1: R16.2 ; port LED1
LED2: R19.2 ; port LED2
LED3: R22.2 ; port LED3
PS2_CLK: D5.3 R23.1 ; port PS2_CLK
PS2_DATA: D6.3 R20.1 ; port PS2_DATA
UART_RXD: U3.1(TXD) ; port UART_RXD
UART_TXD: U3.5(RXD) ; port UART_TXD
NetC40_2: C40.2 J4.7 J4.8 J4.9
NetC43_2: C43.2 J6.5 J6.6
NetD2_1: D2.1(A) R16.1
NetD3_1: D3.1(A) R19.1
NetD4_1: D4.1(A) R22.1
NetD7_3: D7.3 J6.3 U3.15(USBDP)
NetD10_3: D10.3 J6.2 U3.16(USBDM)
NetD17_1: D17.1(A) R27.1
NetD17_2: D17.2(K) U3.23(CBUS0)
NetD18_1: D18.1(A) R28.1
NetD18_2: D18.2(K) U3.22(CBUS1)
NetJ4_1: J4.1 R18.1 R21.2
NetJ4_5: J4.5 R17.1 R24.2
NetR14_1: R14.1 R17.2
NetR15_1: R15.1 R18.2
NetR20_2: R20.2 R21.1
NetR23_2: R23.2 R24.1

Not connected (* = marked no-connect by the designer): J4 2* 6*; U3 2(DTR#)* 3(RTS#)* 6(RI#)* 8(NC)* 9(DSR#)* 10(DCD#)* 11(CTS#)* 12(CBUS4)* 13(CBUS2)* 14(CBUS3)* 19(RESET#)* 24(NC)* 27(OSCI)* 28(OSCO)*

### Buses and harness runs
bus GPI[0..7] = port GPI[0..7]
bus GPIO[0..3] = port GPIO[0..3]

### Layout directives
net class PORTS: BTN1, BTN2, GPI0, GPI1, GPI2, GPI3, GPI4, GPI5, GPI6, GPI7, GPIO0, GPIO1, GPIO2, GPIO3, LED1, LED2, LED3, PS2_CLK, PS2_DATA, UART_RXD, UART_TXD

### Library data of the parts
C39-C46 = Cap: Capacitor; Published: 8-Jun-2000; LatestRevisionDate: 17-Jul-2002; LatestRevisionNote: Re-released for DXP Platform.; PackageReference: RAD-0.3; Publisher: Altium Limited; PackageDescription: Radial Cap, Thru-Hole; 2 Leads; 0.3 in Pin Spacing
D2-D4 = LED3: Amber; Published: 8-Jun-2000; LatestRevisionDate: 17-Dec-2003; LatestRevisionNote: PCB Footprint replaced.; DatasheetVersion: 16-Apr-2002; PackageVersion: 16-Apr-2002; PackageReference: 3.5X2.8X1.9; Publisher: Altium Limited; PackageDescription: SM LED; 2 C-Bend Leads; Body 3.5 x 2.8 x 1.9 mm, inc leads (LxWxH typ)
D17 = LED3: Green; Published: 8-Jun-2000; LatestRevisionDate: 17-Dec-2003; LatestRevisionNote: PCB Footprint replaced.; DatasheetVersion: 16-Apr-2002; PackageVersion: 16-Apr-2002; PackageReference: 3.5X2.8X1.9; Publisher: Altium Limited; PackageDescription: SM LED; 2 C-Bend Leads; Body 3.5 x 2.8 x 1.9 mm, inc leads (LxWxH typ)
D18 = LED3: Red; Published: 8-Jun-2000; LatestRevisionDate: 17-Dec-2003; LatestRevisionNote: PCB Footprint replaced.; DatasheetVersion: 16-Apr-2002; PackageVersion: 16-Apr-2002; PackageReference: 3.5X2.8X1.9; Publisher: Altium Limited; PackageDescription: SM LED; 2 C-Bend Leads; Body 3.5 x 2.8 x 1.9 mm, inc leads (LxWxH typ)
J4 = PS2_Socket
J5 = Header 10X2A: Header, 10-Pin, Dual row; LatestRevisionDate: 17-Jul-2002; LatestRevisionNote: Re-released for DXP Platform.; Publisher: Altium Limited
J6 = USB_B
J8 = Header 3X2A: Header, 3-Pin, Dual row; LatestRevisionDate: 17-Jul-2002; LatestRevisionNote: Re-released for DXP Platform.; Publisher: Altium Limited
R14-R28 = Res2: Resistor; Published: 8-Jun-2000; LatestRevisionDate: 17-Jul-2002; LatestRevisionNote: Re-released for DXP Platform.; PackageReference: AXIAL-0.4; Publisher: Altium Limited; PackageDescription: Axial Device, Thru-Hole; 2 Leads; 0.4 in Pin Spacing
S1 S2 = SW-PB: Switch; Published: 24-Mar-1999; LatestRevisionDate: 17-Jul-2002; LatestRevisionNote: Re-released for DXP Platform.; PackageReference: SPST-2; Publisher: Altium Limited; PackageDescription: Switch; 2 Leads

## Sheet power.SchDoc
size A4
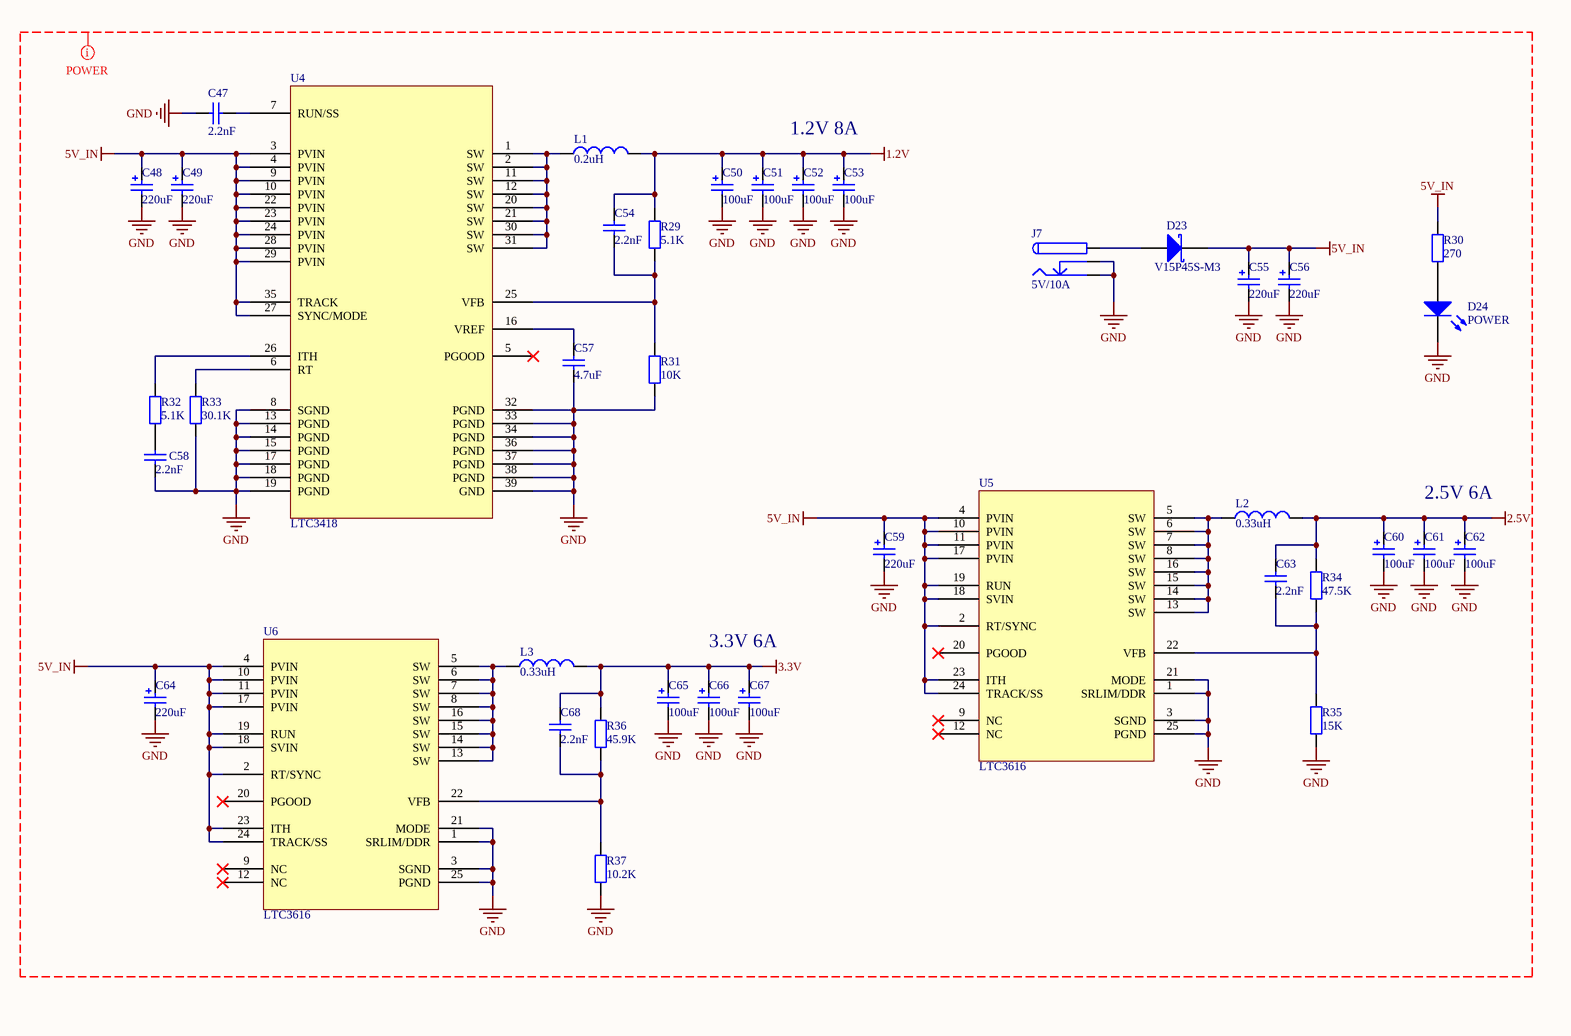
[diagram p4: power.SchDoc]

### Parts
C47  value 2.2nF  [1608[0603]]  (hidden comment: Cap)
C48  value 220uF  [C220_POLARIZED]  (hidden comment: Cap Pol2)
C49  value 220uF  [C220_POLARIZED]  (hidden comment: Cap Pol2)
C50  value 100uF  [C1206_POLARIZED]  (hidden comment: Cap Pol2)
C51  value 100uF  [C1206_POLARIZED]  (hidden comment: Cap Pol2)
C52  value 100uF  [C1206_POLARIZED]  (hidden comment: Cap Pol2)
C53  value 100uF  [C1206_POLARIZED]  (hidden comment: Cap Pol2)
C54  value 2.2nF  [1608[0603]]  (hidden comment: Cap)
C55  value 220uF  [C220_POLARIZED]  (hidden comment: Cap Pol2)
C56  value 220uF  [C220_POLARIZED]  (hidden comment: Cap Pol2)
C57  value 4.7uF  [C0805]  (hidden comment: Cap)
C58  value 2.2nF  [1608[0603]]  (hidden comment: Cap)
C59  value 220uF  [C220_POLARIZED]  (hidden comment: Cap Pol2)
C60  value 100uF  [C1206_POLARIZED]  (hidden comment: Cap Pol2)
C61  value 100uF  [C1206_POLARIZED]  (hidden comment: Cap Pol2)
C62  value 100uF  [C1206_POLARIZED]  (hidden comment: Cap Pol2)
C63  value 2.2nF  [1608[0603]]  (hidden comment: Cap)
C64  value 220uF  [C220_POLARIZED]  (hidden comment: Cap Pol2)
C65  value 100uF  [C1206_POLARIZED]  (hidden comment: Cap Pol2)
C66  value 100uF  [C1206_POLARIZED]  (hidden comment: Cap Pol2)
C67  value 100uF  [C1206_POLARIZED]  (hidden comment: Cap Pol2)
C68  value 2.2nF  [1608[0603]]  (hidden comment: Cap)
D23  V15P45S-M3  [TO-227A]
D24  POWER  [led]
J7  5V/10A  [DC_JACK]
L1  value 0.2uH  [INDP7367X100N]  (hidden comment: Inductor)
L2  value 0.33uH  [IHLP-2525CZ]  (hidden comment: Inductor)
L3  value 0.33uH  [IHLP-2525CZ]  (hidden comment: Inductor)
R29  value 5.1K  [J1-0603]  (hidden comment: Res2)
R30  value 270  [6-0805_N]  (hidden comment: Res2)
R31  value 10K  [J1-0603]  (hidden comment: Res2)
R32  value 5.1K  [J1-0603]  (hidden comment: Res2)
R33  value 30.1K  [J1-0603]  (hidden comment: Res2)
R34  value 47.5K  [J1-0603]  (hidden comment: Res2)
R35  value 15K  [J1-0603]  (hidden comment: Res2)
R36  value 45.9K  [J1-0603]  (hidden comment: Res2)
R37  value 10.2K  [J1-0603]  (hidden comment: Res2)
U4  LTC3418  [QFN38]
U5  LTC3616  [QFN24]
U6  LTC3616  [QFN24]

### Nets
1.2V: C50.1 C51.1 C52.1 C53.1 C54.2 L1.2 R29.1
2.5V: C60.1 C61.1 C62.1 C63.2 L2.2 R34.1
3.3V: C65.1 C66.1 C67.1 C68.2 L3.2 R36.1
5V_IN: C48.1 C49.1 C55.1 C56.1 C59.1 C64.1 D23.2(K) R30.1 U4.3(PVIN) U4.4(PVIN) U4.9(PVIN) U4.10(PVIN) U4.22(PVIN) U4.23(PVIN) U4.24(PVIN) U4.27(SYNC/MODE) U4.28(PVIN) U4.29(PVIN) U4.35(TRACK) U5.2(RT/SYNC) U5.4(PVIN) U5.10(PVIN) U5.11(PVIN) U5.17(PVIN) U5.18(SVIN) U5.19(RUN) U5.23(ITH) U5.24(TRACK/SS) U6.2(RT/SYNC) U6.4(PVIN) U6.10(PVIN) U6.11(PVIN) U6.17(PVIN) U6.18(SVIN) U6.19(RUN) U6.23(ITH) U6.24(TRACK/SS)
GND: C47.2 C48.2 C49.2 C50.2 C51.2 C52.2 C53.2 C55.2 C56.2 C57.1 C58.1 C59.2 C60.2 C61.2 C62.2 C64.2 C65.2 C66.2 C67.2 D24.2(K) J7.2 J7.3 R31.2 R33.2 R35.2 R37.2 U4.8(SGND) U4.13(PGND) U4.14(PGND) U4.15(PGND) U4.17(PGND) U4.18(PGND) U4.19(PGND) U4.32(PGND) U4.33(PGND) U4.34(PGND) U4.36(PGND) U4.37(PGND) U4.38(PGND) U4.39(GND) U5.1(SRLIM/DDR) U5.3(SGND) U5.21(MODE) U5.25(PGND) U6.1(SRLIM/DDR) U6.3(SGND) U6.21(MODE) U6.25(PGND)
NetC47_1: C47.1 U4.7(RUN/SS)
NetC54_1: C54.1 R29.2 R31.1 U4.25(VFB)
NetC57_2: C57.2 U4.16(VREF)
NetC58_2: C58.2 R32.2
NetC63_1: C63.1 R34.2 R35.1 U5.22(VFB)
NetC68_1: C68.1 R36.2 R37.1 U6.22(VFB)
NetD23_1: D23.1(A) J7.1
NetD24_1: D24.1(A) R30.2
NetL1_1: L1.1 U4.1(SW) U4.2(SW) U4.11(SW) U4.12(SW) U4.20(SW) U4.21(SW) U4.30(SW) U4.31(SW)
NetL2_1: L2.1 U5.5(SW) U5.6(SW) U5.7(SW) U5.8(SW) U5.13(SW) U5.14(SW) U5.15(SW) U5.16(SW)
NetL3_1: L3.1 U6.5(SW) U6.6(SW) U6.7(SW) U6.8(SW) U6.13(SW) U6.14(SW) U6.15(SW) U6.16(SW)
NetR32_1: R32.1 U4.26(ITH)
NetR33_1: R33.1 U4.6(RT)

Not connected (* = marked no-connect by the designer): U4 5(PGOOD)*; U5 9(NC)* 12(NC)* 20(PGOOD)*; U6 9(NC)* 12(NC)* 20(PGOOD)*

### Layout directives
net class POWER: 1.2V, 2.5V, 3.3V, 5V_IN, GND

### Notes on the sheet
- 1.2V 8A
- 2.5V 6A
- 3.3V 6A

### Library data of the parts
C47 C54 C57 C58 C63 C68 = Cap: Capacitor; Published: 8-Jun-2000; LatestRevisionDate: 17-Jul-2002; LatestRevisionNote: Re-released for DXP Platform.; PackageReference: RAD-0.3; Publisher: Altium Limited; PackageDescription: Radial Cap, Thru-Hole; 2 Leads; 0.3 in Pin Spacing
C48-C53 C55 C56 C59-C62 C64-C67 = Cap Pol2: Polarized Capacitor (Axial); Published: 8-Jun-2000; LatestRevisionDate: 17-Jul-2002; LatestRevisionNote: Re-released for DXP Platform.; PackageReference: POLAR0.8; Publisher: Altium Limited; PackageDescription: Polarized Capacitor; 2 Leads
D23 = D Schottky: Schottky Diode; Published: 8-Jun-2000; LatestRevisionDate: 17-Jul-2002; LatestRevisionNote: Re-released for DXP Platform.; PackageReference: SMB; Publisher: Altium Limited; PackageDescription: DO-214-AA/SMB; 2 C-Bend Leads; Body 5.3 x 3.6 mm, inc. leads (LxW); Code_JEDEC: DO-214-AA
D24 = LED3: Green; Published: 8-Jun-2000; LatestRevisionDate: 17-Dec-2003; LatestRevisionNote: PCB Footprint replaced.; DatasheetVersion: 16-Apr-2002; PackageVersion: 16-Apr-2002; PackageReference: 3.5X2.8X1.9; Publisher: Altium Limited; PackageDescription: SM LED; 2 C-Bend Leads; Body 3.5 x 2.8 x 1.9 mm, inc leads (LxWxH typ)
J7 = PWR2.5: Low Voltage Power Supply Connector; Published: 17-Dec-2003; DatasheetDocument: 09-May-2002; Publisher: Altium Limited; ComponentLink1Description: Manufacturer Link; ComponentLink1URL: http://domino.kycon.com/internet/Products.html
L1-L3 = Inductor: Code_IEC: 1005; Published: 8-Jun-2000; LatestRevisionDate: 29-May-2009; LatestRevisionNote: IPC-7351 Footprint Added.; PackageReference: 0402-A; Publisher: Altium Limited; PackageDescription: Chip Inductor; Code_JEITA: 0402
R29-R37 = Res2: Resistor; Published: 8-Jun-2000; LatestRevisionDate: 17-Jul-2002; LatestRevisionNote: Re-released for DXP Platform.; PackageReference: AXIAL-0.4; Publisher: Altium Limited; PackageDescription: Axial Device, Thru-Hole; 2 Leads; 0.4 in Pin Spacing
U5 U6 = LTC3616: Step-Down, 6A, 4MHz

## Sheet memory.SchDoc
size A4
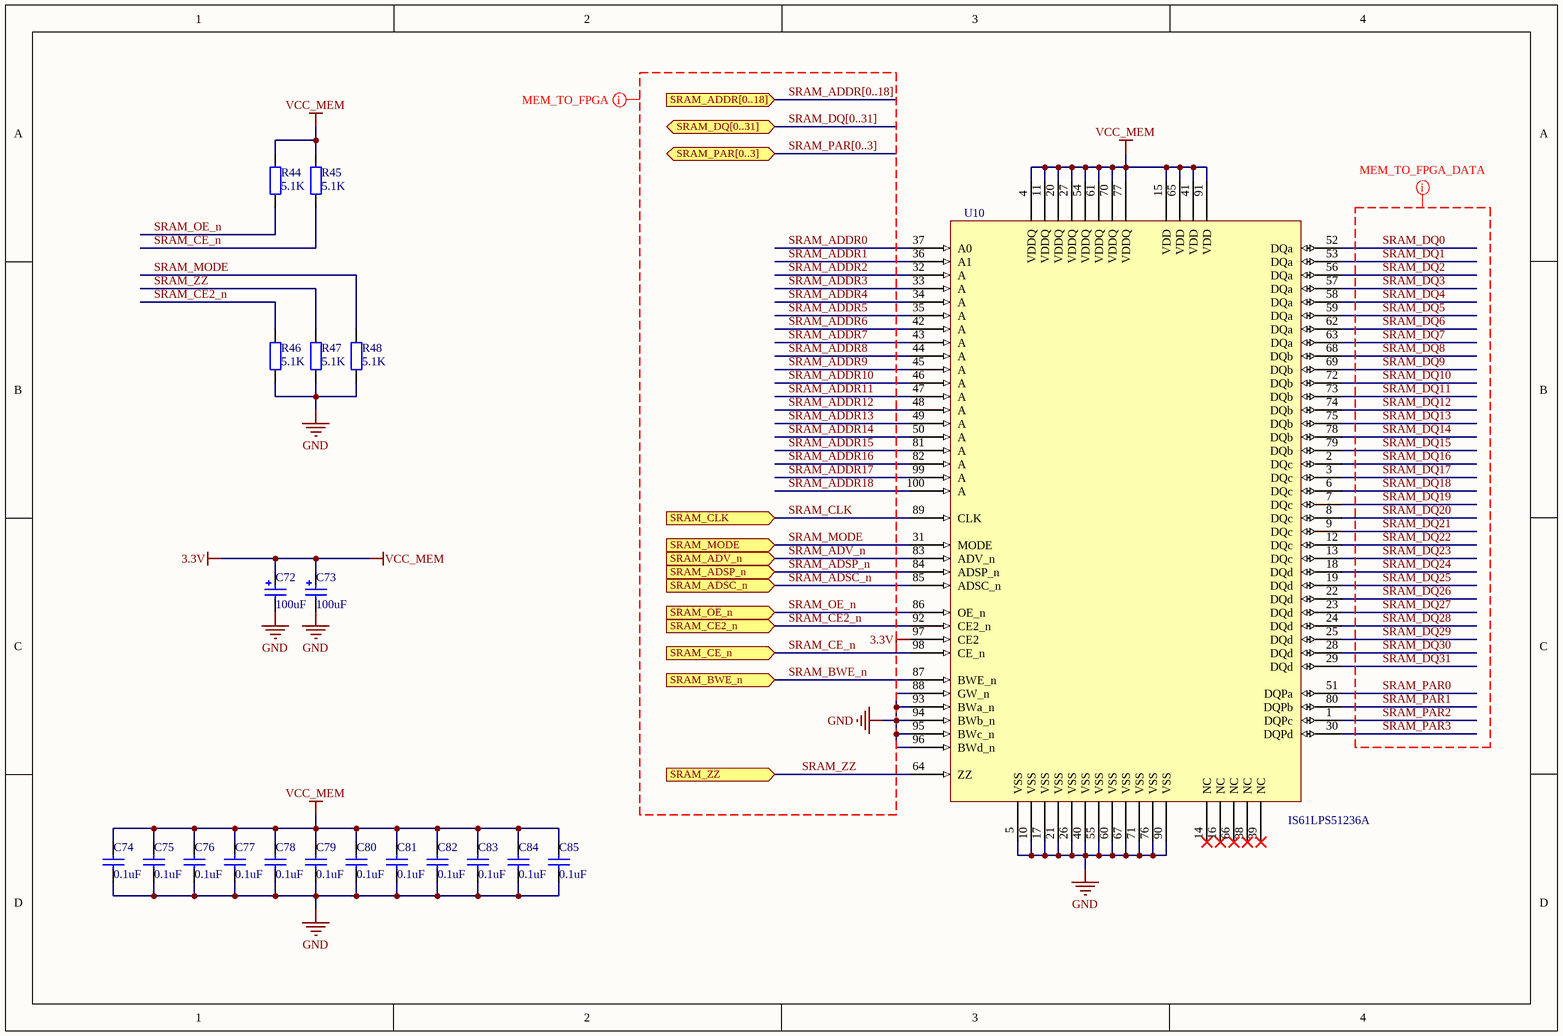
[diagram p5: memory.SchDoc]

### Parts
C72  value 100uF  [C1206_POLARIZED]  (hidden comment: Cap Pol2)
C73  value 100uF  [C1206_POLARIZED]  (hidden comment: Cap Pol2)
C74  value 0.1uF  [0402]  (hidden comment: Cap)
C75  value 0.1uF  [0402]  (hidden comment: Cap)
C76  value 0.1uF  [0402]  (hidden comment: Cap)
C77  value 0.1uF  [0402]  (hidden comment: Cap)
C78  value 0.1uF  [0402]  (hidden comment: Cap)
C79  value 0.1uF  [0402]  (hidden comment: Cap)
C80  value 0.1uF  [0402]  (hidden comment: Cap)
C81  value 0.1uF  [0402]  (hidden comment: Cap)
C82  value 0.1uF  [0402]  (hidden comment: Cap)
C83  value 0.1uF  [0402]  (hidden comment: Cap)
C84  value 0.1uF  [0402]  (hidden comment: Cap)
C85  value 0.1uF  [0402]  (hidden comment: Cap)
R44  value 5.1K  [J1-0603]  (hidden comment: Res2)
R45  value 5.1K  [J1-0603]  (hidden comment: Res2)
R46  value 5.1K  [J1-0603]  (hidden comment: Res2)
R47  value 5.1K  [J1-0603]  (hidden comment: Res2)
R48  value 5.1K  [J1-0603]  (hidden comment: Res2)
U10  IS61LPS51236A  [TQFP100]

### Ports
SRAM_ADDR[0..18] (in), SRAM_ADSC_n (in), SRAM_ADSP_n (in), SRAM_ADV_n (in), SRAM_BWE_n (in), SRAM_CE2_n (in), SRAM_CE_n (in), SRAM_CLK (in), SRAM_DQ[0..31] (bidir), SRAM_MODE (in), SRAM_OE_n (in), SRAM_PAR[0..3] (bidir), SRAM_ZZ (in)

### Nets
3.3V: C72.1 C73.1 C74.1 C75.1 C76.1 C77.1 C78.1 C79.1 C80.1 C81.1 C82.1 C83.1 C84.1 C85.1 R44.1 R45.1 U10.4(VDDQ) U10.11(VDDQ) U10.15(VDD) U10.20(VDDQ) U10.27(VDDQ) U10.41(VDD) U10.54(VDDQ) U10.61(VDDQ) U10.65(VDD) U10.70(VDDQ) U10.77(VDDQ) U10.91(VDD) U10.97(CE2)  [also labelled VCC_MEM]
GND: C72.2 C73.2 C74.2 C75.2 C76.2 C77.2 C78.2 C79.2 C80.2 C81.2 C82.2 C83.2 C84.2 C85.2 R46.2 R47.2 R48.2 U10.5(VSS) U10.10(VSS) U10.17(VSS) U10.21(VSS) U10.26(VSS) U10.40(VSS) U10.55(VSS) U10.60(VSS) U10.67(VSS) U10.71(VSS) U10.76(VSS) U10.88(GW_n) U10.90(VSS) U10.93(BWa_n) U10.94(BWb_n) U10.95(BWc_n) U10.96(BWd_n)
SRAM_ADDR0: U10.37(A0)
SRAM_ADDR1: U10.36(A1)
SRAM_ADDR2: U10.32(A)
SRAM_ADDR3: U10.33(A)
SRAM_ADDR4: U10.34(A)
SRAM_ADDR5: U10.35(A)
SRAM_ADDR6: U10.42(A)
SRAM_ADDR7: U10.43(A)
SRAM_ADDR8: U10.44(A)
SRAM_ADDR9: U10.45(A)
SRAM_ADDR10: U10.46(A)
SRAM_ADDR11: U10.47(A)
SRAM_ADDR12: U10.48(A)
SRAM_ADDR13: U10.49(A)
SRAM_ADDR14: U10.50(A)
SRAM_ADDR15: U10.81(A)
SRAM_ADDR16: U10.82(A)
SRAM_ADDR17: U10.99(A)
SRAM_ADDR18: U10.100(A)
SRAM_ADSC_n: U10.85(ADSC_n) ; port SRAM_ADSC_n
SRAM_ADSP_n: U10.84(ADSP_n) ; port SRAM_ADSP_n
SRAM_ADV_n: U10.83(ADV_n) ; port SRAM_ADV_n
SRAM_BWE_n: U10.87(BWE_n) ; port SRAM_BWE_n
SRAM_CE2_n: R46.1 U10.92(CE2_n) ; port SRAM_CE2_n
SRAM_CE_n: R45.2 U10.98(CE_n) ; port SRAM_CE_n
SRAM_CLK: U10.89(CLK) ; port SRAM_CLK
SRAM_DQ0: U10.52(DQa)
SRAM_DQ1: U10.53(DQa)
SRAM_DQ2: U10.56(DQa)
SRAM_DQ3: U10.57(DQa)
SRAM_DQ4: U10.58(DQa)
SRAM_DQ5: U10.59(DQa)
SRAM_DQ6: U10.62(DQa)
SRAM_DQ7: U10.63(DQa)
SRAM_DQ8: U10.68(DQb)
SRAM_DQ9: U10.69(DQb)
SRAM_DQ10: U10.72(DQb)
SRAM_DQ11: U10.73(DQb)
SRAM_DQ12: U10.74(DQb)
SRAM_DQ13: U10.75(DQb)
SRAM_DQ14: U10.78(DQb)
SRAM_DQ15: U10.79(DQb)
SRAM_DQ16: U10.2(DQc)
SRAM_DQ17: U10.3(DQc)
SRAM_DQ18: U10.6(DQc)
SRAM_DQ19: U10.7(DQc)
SRAM_DQ20: U10.8(DQc)
SRAM_DQ21: U10.9(DQc)
SRAM_DQ22: U10.12(DQc)
SRAM_DQ23: U10.13(DQc)
SRAM_DQ24: U10.18(DQd)
SRAM_DQ25: U10.19(DQd)
SRAM_DQ26: U10.22(DQd)
SRAM_DQ27: U10.23(DQd)
SRAM_DQ28: U10.24(DQd)
SRAM_DQ29: U10.25(DQd)
SRAM_DQ30: U10.28(DQd)
SRAM_DQ31: U10.29(DQd)
SRAM_MODE: R48.1 U10.31(MODE) ; port SRAM_MODE
SRAM_OE_n: R44.2 U10.86(OE_n) ; port SRAM_OE_n
SRAM_PAR0: U10.51(DQPa)
SRAM_PAR1: U10.80(DQPb)
SRAM_PAR2: U10.1(DQPc)
SRAM_PAR3: U10.30(DQPd)
SRAM_ZZ: R47.1 U10.64(ZZ) ; port SRAM_ZZ

Not connected (* = marked no-connect by the designer): U10 14(NC)* 16(NC)* 38(NC)* 39(NC)* 66(NC)*

### Buses and harness runs
bus SRAM_ADDR[0..18] = port SRAM_ADDR[0..18]
bus SRAM_DQ[0..31] = port SRAM_DQ[0..31]
bus SRAM_PAR[0..3] = port SRAM_PAR[0..3]

### Layout directives
net class MEM_TO_FPGA: GND, SRAM_ADDR0, SRAM_ADDR1, SRAM_ADDR2, SRAM_ADDR3, SRAM_ADDR4, SRAM_ADDR5, SRAM_ADDR6, SRAM_ADDR7, SRAM_ADDR8, SRAM_ADDR9, SRAM_ADDR10, SRAM_ADDR11, SRAM_ADDR12, SRAM_ADDR13, SRAM_ADDR14, SRAM_ADDR15, SRAM_ADDR16, SRAM_ADDR17, SRAM_ADDR18, SRAM_ADDR[0..18], SRAM_ADSC_n, SRAM_ADSP_n, SRAM_ADV_n, SRAM_BWE_n, SRAM_CE2_n, SRAM_CE_n, SRAM_CLK, SRAM_DQ[0..31], SRAM_MODE, SRAM_OE_n, SRAM_PAR[0..3], SRAM_ZZ
net class MEM_TO_FPGA_DATA; net class MEM_TO_FPGA: SRAM_DQ0, SRAM_DQ1, SRAM_DQ2, SRAM_DQ3, SRAM_DQ4, SRAM_DQ5, SRAM_DQ6, SRAM_DQ7, SRAM_DQ8, SRAM_DQ9, SRAM_DQ10, SRAM_DQ11, SRAM_DQ12, SRAM_DQ13, SRAM_DQ14, SRAM_DQ15, SRAM_DQ16, SRAM_DQ17, SRAM_DQ18, SRAM_DQ19, SRAM_DQ20, SRAM_DQ21, SRAM_DQ22, SRAM_DQ23, SRAM_DQ24, SRAM_DQ25, SRAM_DQ26, SRAM_DQ27, SRAM_DQ28, SRAM_DQ29, SRAM_DQ30, SRAM_DQ31, SRAM_PAR0, SRAM_PAR1, SRAM_PAR2, SRAM_PAR3

### Library data of the parts
C72 C73 = Cap Pol2: Polarized Capacitor (Axial); Published: 8-Jun-2000; LatestRevisionDate: 17-Jul-2002; LatestRevisionNote: Re-released for DXP Platform.; PackageReference: POLAR0.8; Publisher: Altium Limited; PackageDescription: Polarized Capacitor; 2 Leads
C74-C85 = Cap: Capacitor; Published: 8-Jun-2000; LatestRevisionDate: 17-Jul-2002; LatestRevisionNote: Re-released for DXP Platform.; PackageReference: RAD-0.3; Publisher: Altium Limited; PackageDescription: Radial Cap, Thru-Hole; 2 Leads; 0.3 in Pin Spacing
R44-R48 = Res2: Resistor; Published: 8-Jun-2000; LatestRevisionDate: 17-Jul-2002; LatestRevisionNote: Re-released for DXP Platform.; PackageReference: AXIAL-0.4; Publisher: Altium Limited; PackageDescription: Axial Device, Thru-Hole; 2 Leads; 0.4 in Pin Spacing
U10 = IS61LPS51236A: 18Mb 36-bit SRAM

## Sheet core_power.SchDoc
size A4
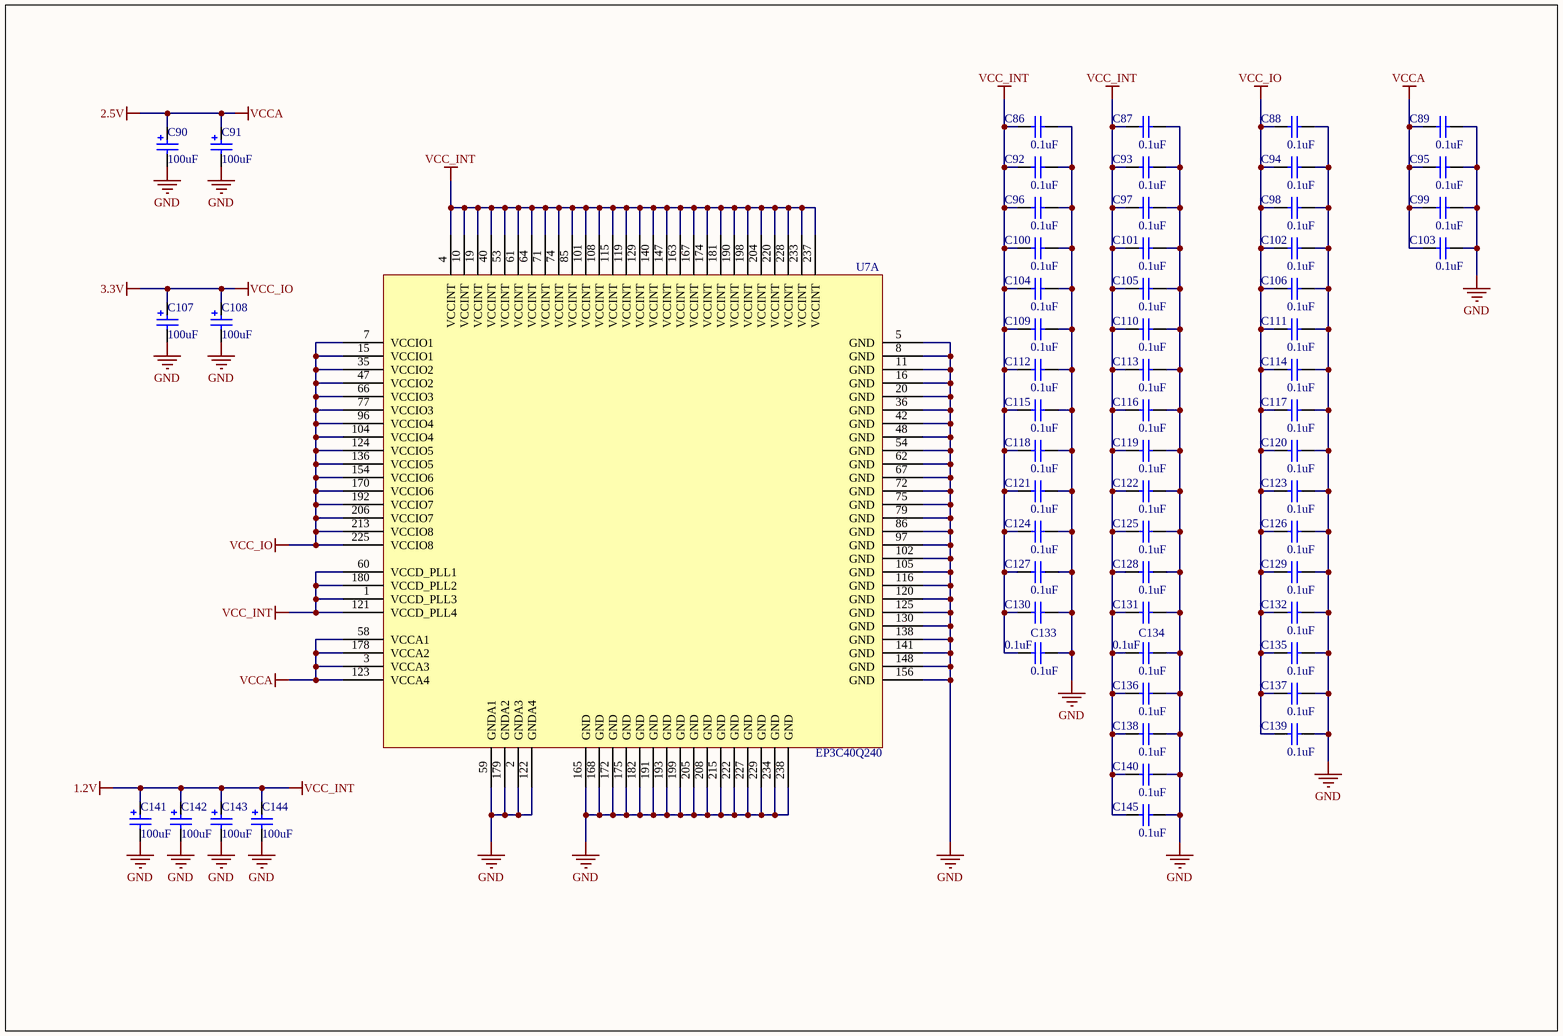
[diagram p6: core_power.SchDoc]

### Parts
C86  value 0.1uF  [0402]  (hidden comment: Cap)
C87  value 0.1uF  [0402]  (hidden comment: Cap)
C88  value 0.1uF  [0402]  (hidden comment: Cap)
C89  value 0.1uF  [0402]  (hidden comment: Cap)
C90  value 100uF  [C1206_POLARIZED]  (hidden comment: Cap)
C91  value 100uF  [C1206_POLARIZED]  (hidden comment: Cap)
C92  value 0.1uF  [0402]  (hidden comment: Cap)
C93  value 0.1uF  [0402]  (hidden comment: Cap)
C94  value 0.1uF  [0402]  (hidden comment: Cap)
C95  value 0.1uF  [0402]  (hidden comment: Cap)
C96  value 0.1uF  [0402]  (hidden comment: Cap)
C97  value 0.1uF  [0402]  (hidden comment: Cap)
C98  value 0.1uF  [0402]  (hidden comment: Cap)
C99  value 0.1uF  [0402]  (hidden comment: Cap)
C100  value 0.1uF  [0402]  (hidden comment: Cap)
C101  value 0.1uF  [0402]  (hidden comment: Cap)
C102  value 0.1uF  [0402]  (hidden comment: Cap)
C103  value 0.1uF  [0402]  (hidden comment: Cap)
C104  value 0.1uF  [0402]  (hidden comment: Cap)
C105  value 0.1uF  [0402]  (hidden comment: Cap)
C106  value 0.1uF  [0402]  (hidden comment: Cap)
C107  value 100uF  [C1206_POLARIZED]  (hidden comment: Cap)
C108  value 100uF  [C1206_POLARIZED]  (hidden comment: Cap)
C109  value 0.1uF  [0402]  (hidden comment: Cap)
C110  value 0.1uF  [0402]  (hidden comment: Cap)
C111  value 0.1uF  [0402]  (hidden comment: Cap)
C112  value 0.1uF  [0402]  (hidden comment: Cap)
C113  value 0.1uF  [0402]  (hidden comment: Cap)
C114  value 0.1uF  [0402]  (hidden comment: Cap)
C115  value 0.1uF  [0402]  (hidden comment: Cap)
C116  value 0.1uF  [0402]  (hidden comment: Cap)
C117  value 0.1uF  [0402]  (hidden comment: Cap)
C118  value 0.1uF  [0402]  (hidden comment: Cap)
C119  value 0.1uF  [0402]  (hidden comment: Cap)
C120  value 0.1uF  [0402]  (hidden comment: Cap)
C121  value 0.1uF  [0402]  (hidden comment: Cap)
C122  value 0.1uF  [0402]  (hidden comment: Cap)
C123  value 0.1uF  [0402]  (hidden comment: Cap)
C124  value 0.1uF  [0402]  (hidden comment: Cap)
C125  value 0.1uF  [0402]  (hidden comment: Cap)
C126  value 0.1uF  [0402]  (hidden comment: Cap)
C127  value 0.1uF  [0402]  (hidden comment: Cap)
C128  value 0.1uF  [0402]  (hidden comment: Cap)
C129  value 0.1uF  [0402]  (hidden comment: Cap)
C130  value 0.1uF  [0402]  (hidden comment: Cap)
C131  value 0.1uF  [0402]  (hidden comment: Cap)
C132  value 0.1uF  [0402]  (hidden comment: Cap)
C133  value 0.1uF  [0402]  (hidden comment: Cap)
C134  value 0.1uF  [0402]  (hidden comment: Cap)
C135  value 0.1uF  [0402]  (hidden comment: Cap)
C136  value 0.1uF  [0402]  (hidden comment: Cap)
C137  value 0.1uF  [0402]  (hidden comment: Cap)
C138  value 0.1uF  [0402]  (hidden comment: Cap)
C139  value 0.1uF  [0402]  (hidden comment: Cap)
C140  value 0.1uF  [0402]  (hidden comment: Cap)
C141  value 100uF  [C1206_POLARIZED]  (hidden comment: Cap Pol2)
C142  value 100uF  [C1206_POLARIZED]  (hidden comment: Cap Pol2)
C143  value 100uF  [C1206_POLARIZED]  (hidden comment: Cap)
C144  value 100uF  [C1206_POLARIZED]  (hidden comment: Cap)
C145  value 0.1uF  [0402]  (hidden comment: Cap)
U7  EP3C40Q240  [PQFP240]  (part A of 3)

### Nets
1.2V: C86.1 C87.1 C92.1 C93.1 C96.1 C97.1 C100.1 C101.1 C104.1 C105.1 C109.1 C110.1 C112.1 C113.1 C115.1 C116.1 C118.1 C119.1 C121.1 C122.1 C124.1 C125.1 C127.1 C128.1 C130.1 C131.1 C133.1 C134.1 C136.1 C138.1 C140.1 C141.1 C142.1 C143.1 C144.1 C145.1 U7.1(VCCD_PLL3) U7.4(VCCINT) U7.10(VCCINT) U7.19(VCCINT) U7.40(VCCINT) U7.53(VCCINT) U7.60(VCCD_PLL1) U7.61(VCCINT) U7.64(VCCINT) U7.71(VCCINT) U7.74(VCCINT) U7.85(VCCINT) U7.101(VCCINT) U7.108(VCCINT) U7.115(VCCINT) U7.119(VCCINT) U7.121(VCCD_PLL4) U7.129(VCCINT) U7.140(VCCINT) U7.147(VCCINT) U7.163(VCCINT) U7.167(VCCINT) U7.174(VCCINT) U7.180(VCCD_PLL2) U7.181(VCCINT) U7.190(VCCINT) U7.198(VCCINT) U7.204(VCCINT) U7.220(VCCINT) U7.228(VCCINT) U7.233(VCCINT) U7.237(VCCINT)  [also labelled VCC_INT]
2.5V: C89.1 C90.1 C91.1 C95.1 C99.1 C103.1 U7.3(VCCA3) U7.58(VCCA1) U7.123(VCCA4) U7.178(VCCA2)  [also labelled VCCA]
3.3V: C88.1 C94.1 C98.1 C102.1 C106.1 C107.1 C108.1 C111.1 C114.1 C117.1 C120.1 C123.1 C126.1 C129.1 C132.1 C135.1 C137.1 C139.1 U7.7(VCCIO1) U7.15(VCCIO1) U7.35(VCCIO2) U7.47(VCCIO2) U7.66(VCCIO3) U7.77(VCCIO3) U7.96(VCCIO4) U7.104(VCCIO4) U7.124(VCCIO5) U7.136(VCCIO5) U7.154(VCCIO6) U7.170(VCCIO6) U7.192(VCCIO7) U7.206(VCCIO7) U7.213(VCCIO8) U7.225(VCCIO8)  [also labelled VCC_IO]
GND: C86.2 C87.2 C88.2 C89.2 C90.2 C91.2 C92.2 C93.2 C94.2 C95.2 C96.2 C97.2 C98.2 C99.2 C100.2 C101.2 C102.2 C103.2 C104.2 C105.2 C106.2 C107.2 C108.2 C109.2 C110.2 C111.2 C112.2 C113.2 C114.2 C115.2 C116.2 C117.2 C118.2 C119.2 C120.2 C121.2 C122.2 C123.2 C124.2 C125.2 C126.2 C127.2 C128.2 C129.2 C130.2 C131.2 C132.2 C133.2 C134.2 C135.2 C136.2 C137.2 C138.2 C139.2 C140.2 C141.2 C142.2 C143.2 C144.2 C145.2 U7.2(GNDA3) U7.5(GND) U7.8(GND) U7.11(GND) U7.16(GND) U7.20(GND) U7.36(GND) U7.42(GND) U7.48(GND) U7.54(GND) U7.59(GNDA1) U7.62(GND) U7.67(GND) U7.72(GND) U7.75(GND) U7.79(GND) U7.86(GND) U7.97(GND) U7.102(GND) U7.105(GND) U7.116(GND) U7.120(GND) U7.122(GNDA4) U7.125(GND) U7.130(GND) U7.138(GND) U7.141(GND) U7.148(GND) U7.156(GND) U7.165(GND) U7.168(GND) U7.172(GND) U7.175(GND) U7.179(GNDA2) U7.182(GND) U7.191(GND) U7.193(GND) U7.199(GND) U7.205(GND) U7.208(GND) U7.215(GND) U7.222(GND) U7.227(GND) U7.229(GND) U7.234(GND) U7.238(GND)

### Library data of the parts
C86-C89 C92-C106 C109-C140 C145 = Cap: Capacitor; Published: 8-Jun-2000; LatestRevisionDate: 17-Jul-2002; LatestRevisionNote: Re-released for DXP Platform.; PackageReference: RAD-0.3; Publisher: Altium Limited; PackageDescription: Radial Cap, Thru-Hole; 2 Leads; 0.3 in Pin Spacing
C90 C91 C107 C108 C141-C144 = Cap Pol2: Polarized Capacitor (Axial); Published: 8-Jun-2000; LatestRevisionDate: 17-Jul-2002; LatestRevisionNote: Re-released for DXP Platform.; PackageReference: POLAR0.8; Publisher: Altium Limited; PackageDescription: Polarized Capacitor; 2 Leads